# Altium project SCB.PrjPCB (part 1 of 8)
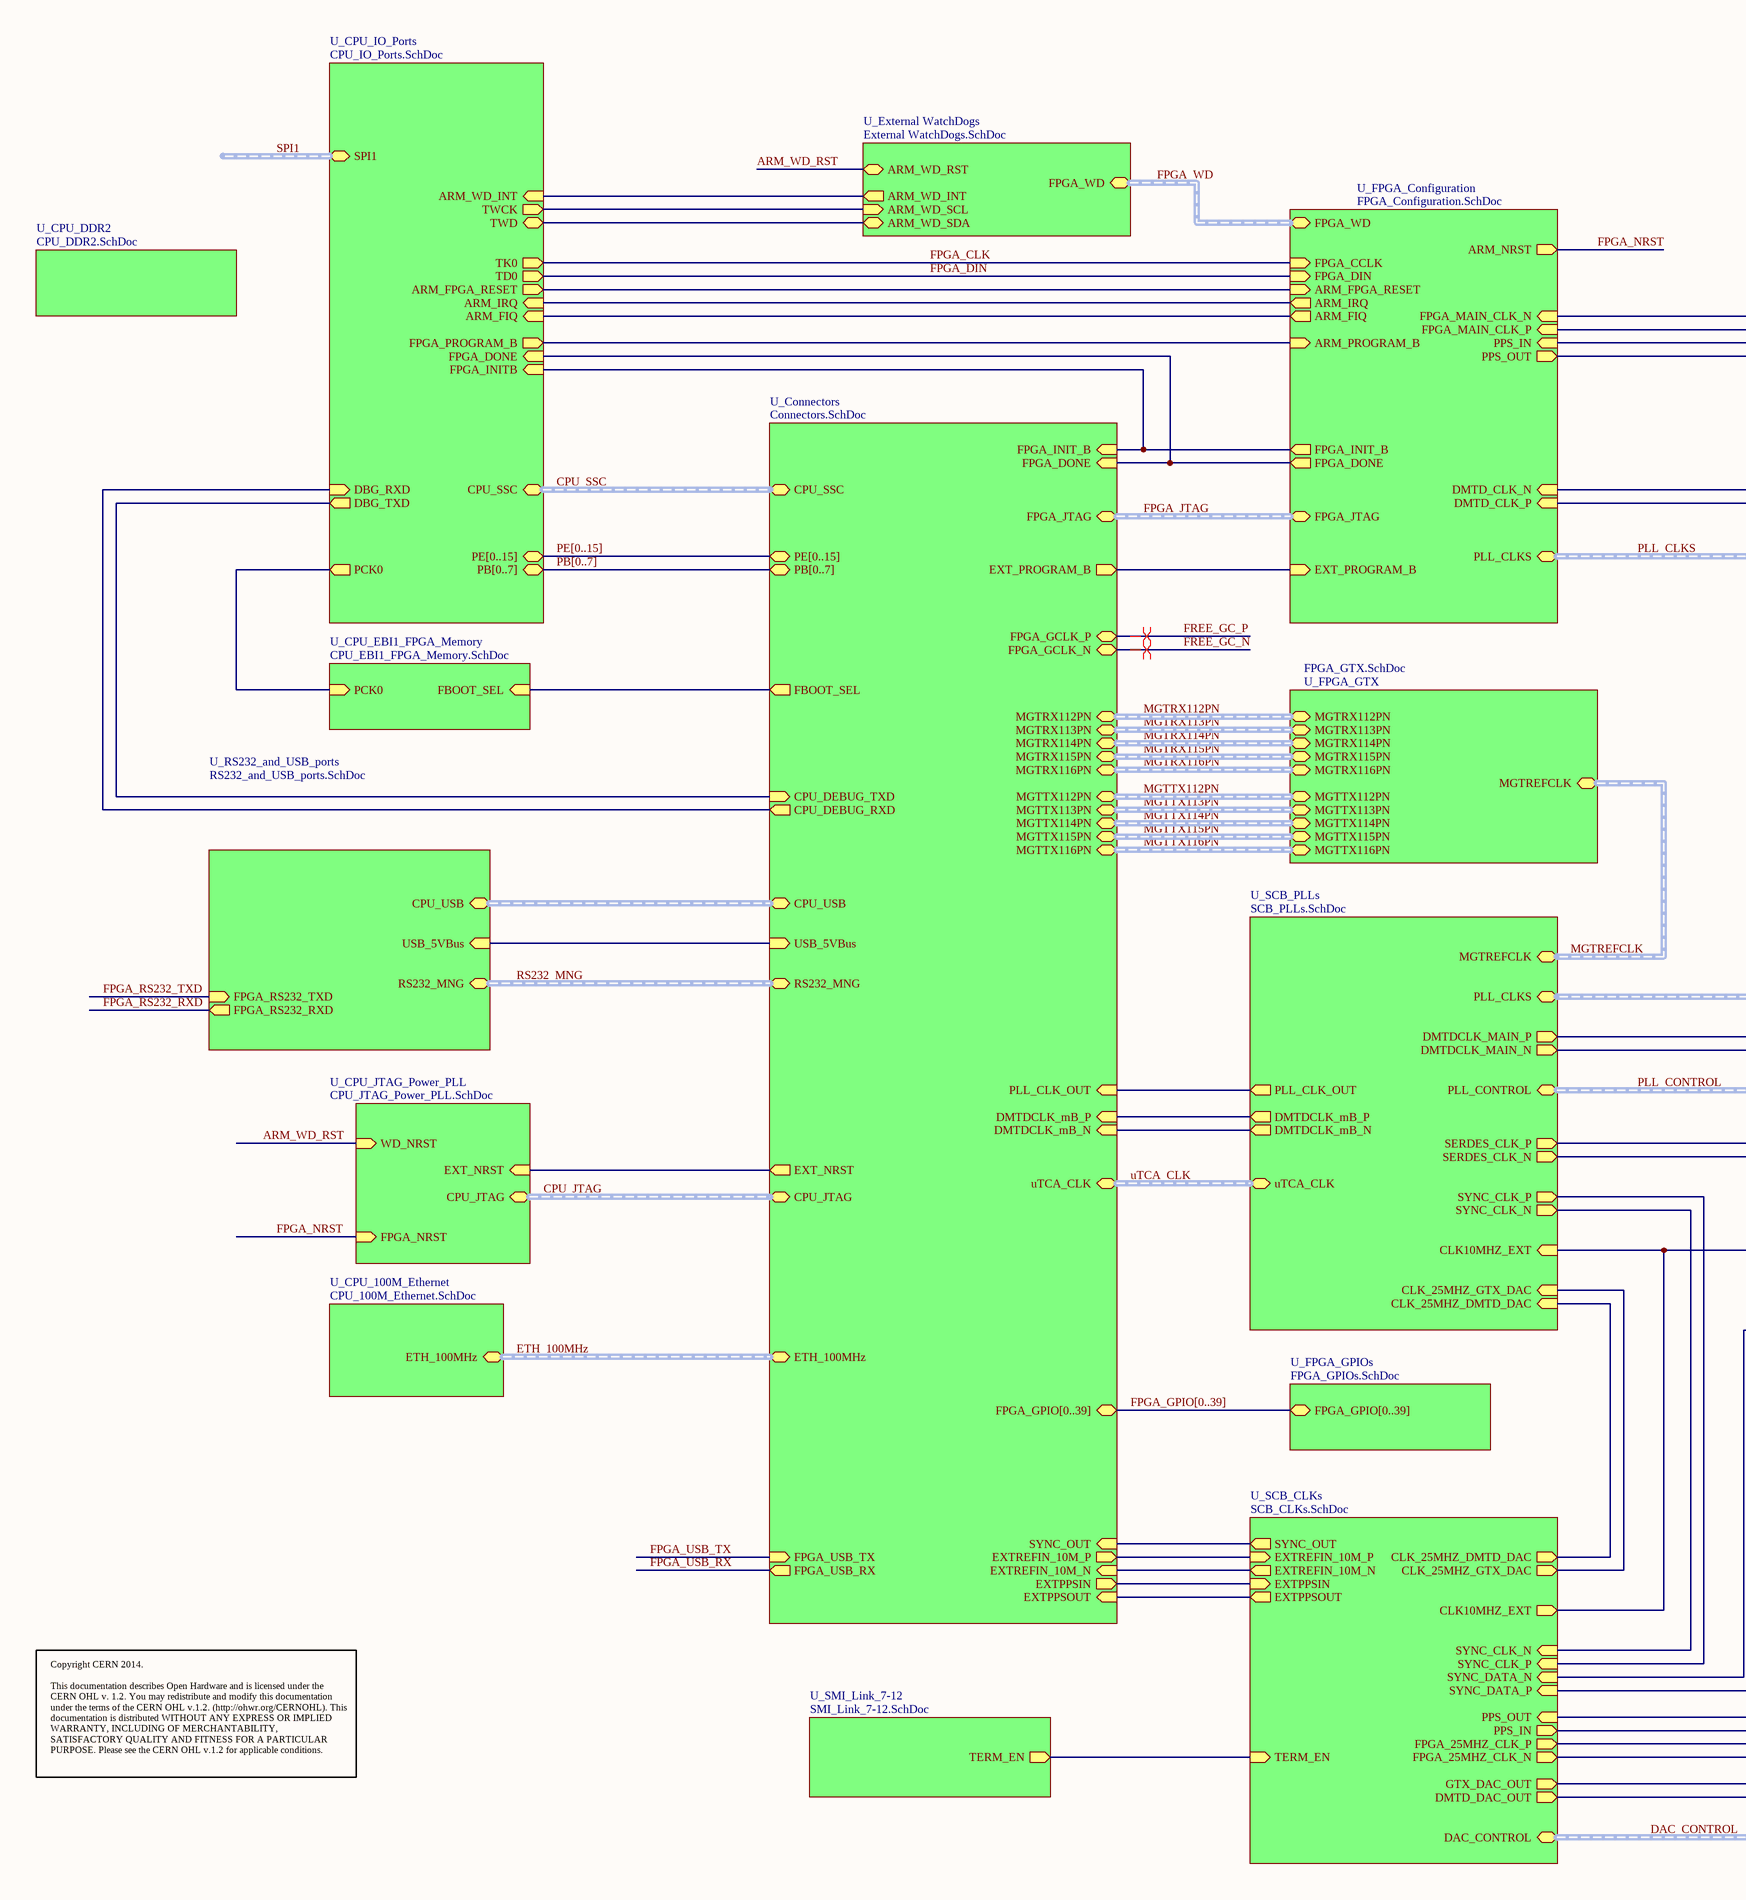
[diagram p0: SCB_MAIN.SchDoc, left]
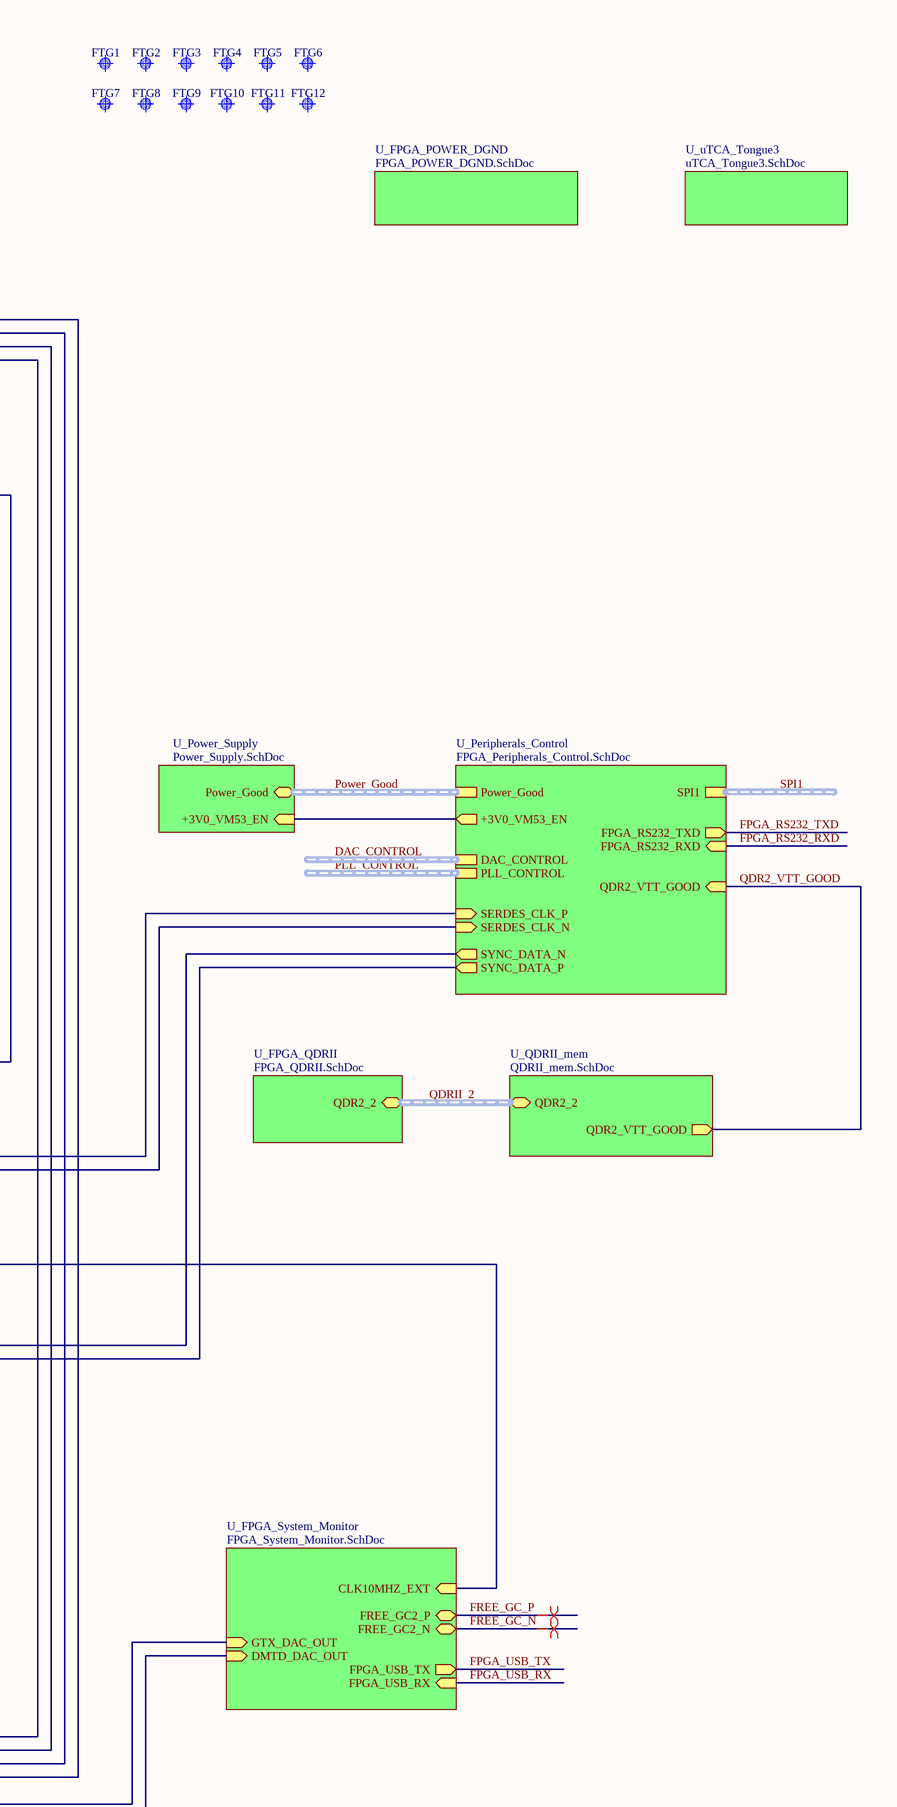
[diagram p1: SCB_MAIN.SchDoc, right]
23 sheets, 767 parts. Net scope: hierarchical (ports join the sheet entries above them; power ports are global).
Board file: uTCA_MCH_PCB3.pcbdoc
Sheets:
  SCB_MAIN.SchDoc
    U_Connectors = Connectors.SchDoc
    U_CPU_JTAG_Power_PLL = CPU_JTAG_Power_PLL.SchDoc
    U_RS232_and_USB_ports = RS232_and_USB_ports.SchDoc
    U_SCB_CLKs = SCB_CLKs.SchDoc
    U_FPGA_GTX = FPGA_GTX.SchDoc
    U_CPU_100M_Ethernet = CPU_100M_Ethernet.SchDoc
    U_SMI_Link_7-12 = SMI_Link_7-12.SchDoc
    U_uTCA_Tongue3 = uTCA_Tongue3.SchDoc
    U_External WatchDogs = External WatchDogs.SchDoc
    U_FPGA_Configuration = FPGA_Configuration.SchDoc
    U_CPU_IO_Ports = CPU_IO_Ports.SchDoc
    U_SCB_PLLs = SCB_PLLs.SchDoc
    U_FPGA_GPIOs = FPGA_GPIOs.SchDoc
    U_FPGA_System_Monitor = FPGA_System_Monitor.SchDoc
    U_Power_Supply = Power_Supply.SchDoc
    U_FPGA_POWER_DGND = FPGA_POWER_DGND.SchDoc
    U_QDRII_mem = QDRII_mem.SchDoc
      U_QDRII_power = QDRII_power.SchDoc
    U_FPGA_QDRII = FPGA_QDRII.SchDoc
    U_Peripherals_Control = FPGA_Peripherals_Control.SchDoc
    U_CPU_EBI1_FPGA_Memory = CPU_EBI1_FPGA_Memory.SchDoc
    U_CPU_DDR2 = CPU_DDR2.SchDoc

## Sheet SCB_MAIN.SchDoc: SCB_MAIN
size A2; Date: 18/06/2014; DrawnBy: J. Gabriel R.E.; Organization: Seven Solutions S.L.; Address1: C/Baza, Parcela 19, Nave 3; Address2: Polígono Ind. Juncaril; Address3: 18210-Peligros-Granada; Address4: Spain; Revision: 3.4; SheetNumber: 1; SheetTotal: 23; WebAddress: www.sevensols.com; Project: White Rabbit; ProjectName: Project Name

### Parts
FTG1  Use only in PCB  [FIDUCIAL_TOP_S100-200]  (value not drawn)
FTG2  Use only in PCB  [FIDUCIAL_TOP_S100-200]  (value not drawn)
FTG3  Use only in PCB  [FIDUCIAL_TOP_S100-200]  (value not drawn)
FTG4  Use only in PCB  [FIDUCIAL_TOP_S100-200]  (value not drawn)
FTG5  Use only in PCB  [FIDUCIAL_TOP_S100-200]  (value not drawn)
FTG6  Use only in PCB  [FIDUCIAL_TOP_S100-200]  (value not drawn)
FTG7  Use only in PCB  [FIDUCIAL_TOP_S100-200]  (value not drawn)
FTG8  Use only in PCB  [FIDUCIAL_TOP_S100-200]  (value not drawn)
FTG9  Use only in PCB  [FIDUCIAL_TOP_S100-200]  (value not drawn)
FTG10  Use only in PCB  [FIDUCIAL_TOP_S100-200]  (value not drawn)
FTG11  Use only in PCB  [FIDUCIAL_TOP_S100-200]  (value not drawn)
FTG12  Use only in PCB  [FIDUCIAL_TOP_S100-200]  (value not drawn)

### Sub-sheets
U_Connectors = Connectors.SchDoc: USB_5VBus (in), CPU_DEBUG_TXD (in), CPU_DEBUG_RXD (out), EXTPPSIN (out), EXTPPSOUT (in), FBOOT_SEL (out), EXT_NRST (out), FPGA_GCLK_P (bidir), EXT_PROGRAM_B (out), FPGA_DONE (in), FPGA_INIT_B (in), FPGA_GPIO[0..39] (bidir), DMTDCLK_mB_P (in), DMTDCLK_mB_N (in), FPGA_GCLK_N (bidir), MGTTX112PN (harness MGTTX112PN), MGTTX113PN (harness MGTTX113PN), MGTTX114PN (harness MGTTX114PN), MGTTX115PN (harness MGTTX115PN), MGTTX116PN (harness MGTTX116PN), MGTRX112PN (harness MGTRX112PN), MGTRX113PN (harness MGTRX113PN), MGTRX114PN (harness MGTRX114PN), MGTRX115PN (harness MGTRX115PN), MGTRX116PN (harness MGTRX116PN), ETH_100MHz (harness ETH_100MHz), uTCA_CLK (harness uTCA_CLK), CPU_JTAG (harness CPU_JTAG), FPGA_JTAG (harness FPGA_JTAG), CPU_SSC (harness CPU_SSC), RS232_MNG (harness RS232_MNG), PE[0..15] (bidir), PB[0..7] (bidir), CPU_USB (harness CPU_USB), EXTREFIN_10M_P (out), EXTREFIN_10M_N (in), FPGA_USB_TX (in), FPGA_USB_RX (out), PLL_CLK_OUT (in), SYNC_OUT (in)
U_CPU_100M_Ethernet = CPU_100M_Ethernet.SchDoc: ETH_100MHz (harness ETH_100MHz)
U_CPU_DDR2 = CPU_DDR2.SchDoc: no entries
U_CPU_EBI1_FPGA_Memory = CPU_EBI1_FPGA_Memory.SchDoc: FBOOT_SEL (in), PCK0 (in)
U_CPU_IO_Ports = CPU_IO_Ports.SchDoc: DBG_TXD (out), DBG_RXD (in), TK0 (out), TD0 (out), FPGA_DONE (in), FPGA_INITB (in), TWD (bidir), TWCK (out), ARM_WD_INT (in), FPGA_PROGRAM_B (out), CPU_SSC (harness CPU_SSC), SPI1 (harness SPI1), ARM_FPGA_RESET (out), PB[0..7] (bidir), PE[0..15] (bidir), ARM_FIQ (in), ARM_IRQ (in), PCK0 (out)
U_CPU_JTAG_Power_PLL = CPU_JTAG_Power_PLL.SchDoc: EXT_NRST (in), WD_NRST (in), FPGA_NRST (in), CPU_JTAG (harness CPU_JTAG)
U_External WatchDogs = External WatchDogs.SchDoc: ARM_WD_SCL (in), ARM_WD_SDA (bidir), ARM_WD_INT (out), ARM_WD_RST (bidir), FPGA_WD (harness FPGA_WD)
U_FPGA_Configuration = FPGA_Configuration.SchDoc: FPGA_DONE (out), FPGA_INIT_B (out), ARM_PROGRAM_B (in), FPGA_CCLK (in), FPGA_DIN (in), EXT_PROGRAM_B (in), ARM_NRST (out), ARM_FIQ (out), ARM_IRQ (out), DMTD_CLK_P (in), DMTD_CLK_N (in), PPS_IN (in), PPS_OUT (out), FPGA_MAIN_CLK_P (in), FPGA_MAIN_CLK_N (in), FPGA_JTAG (harness FPGA_JTAG), FPGA_WD (harness FPGA_WD), ARM_FPGA_RESET (in), PLL_CLKS (harness PLL_CLKS)
U_FPGA_GPIOs = FPGA_GPIOs.SchDoc: FPGA_GPIO[0..39] (bidir)
U_FPGA_GTX = FPGA_GTX.SchDoc: MGTREFCLK (harness MGTREFCLK), MGTRX116PN (harness MGTRX116PN), MGTRX115PN (harness MGTRX115PN), MGTRX114PN (harness MGTRX114PN), MGTRX113PN (harness MGTRX113PN), MGTRX112PN (harness MGTRX112PN), MGTTX112PN (harness MGTTX112PN), MGTTX113PN (harness MGTTX113PN), MGTTX114PN (harness MGTTX114PN), MGTTX115PN (harness MGTTX115PN), MGTTX116PN (harness MGTTX116PN)
U_FPGA_POWER_DGND = FPGA_POWER_DGND.SchDoc: no entries
U_FPGA_QDRII = FPGA_QDRII.SchDoc: QDR2_2 (harness qdr2_2_bus)
U_FPGA_System_Monitor = FPGA_System_Monitor.SchDoc: DMTD_DAC_OUT (in), GTX_DAC_OUT (in), FREE_GC2_P (bidir), FREE_GC2_N (bidir), CLK10MHZ_EXT (in), FPGA_USB_TX (out), FPGA_USB_RX (in)
U_Peripherals_Control = FPGA_Peripherals_Control.SchDoc: SPI1 (harness SPI1), Power_Good (harness Power-Good), DAC_CONTROL (harness DAC_CONTROL), PLL_CONTROL (harness PLL_CONTROL), QDR2_VTT_GOOD (in), +3V0_VM53_EN (out), FPGA_RS232_TXD (out), FPGA_RS232_RXD (in), SYNC_DATA_N (out), SYNC_DATA_P (out), SERDES_CLK_P (in), SERDES_CLK_N (in)
U_Power_Supply = Power_Supply.SchDoc: Power_Good (harness Power-Good), +3V0_VM53_EN (in)
U_QDRII_mem = QDRII_mem.SchDoc: QDR2_VTT_GOOD (out), QDR2_2 (harness qdr2_2_bus)
U_RS232_and_USB_ports = RS232_and_USB_ports.SchDoc: USB_5VBus (in), FPGA_RS232_TXD (in), FPGA_RS232_RXD (out), RS232_MNG (harness RS232_MNG), CPU_USB (harness CPU_USB)
U_SCB_CLKs = SCB_CLKs.SchDoc: CLK10MHZ_EXT (out), CLK_25MHZ_GTX_DAC (out), CLK_25MHZ_DMTD_DAC (out), EXTPPSIN (in), EXTPPSOUT (out), FPGA_25MHZ_CLK_P (out), FPGA_25MHZ_CLK_N (out), DMTD_DAC_OUT (out), GTX_DAC_OUT (out), PPS_IN (out), PPS_OUT (in), DAC_CONTROL (harness DAC_CONTROL), EXTREFIN_10M_P (in), EXTREFIN_10M_N (out), TERM_EN (in), SYNC_OUT (out), SYNC_CLK_N (in), SYNC_CLK_P (in), SYNC_DATA_N (in), SYNC_DATA_P (in)
U_SCB_PLLs = SCB_PLLs.SchDoc: CLK_25MHZ_GTX_DAC (in), CLK10MHZ_EXT (in), DMTDCLK_MAIN_P (out), DMTDCLK_MAIN_N (out), CLK_25MHZ_DMTD_DAC (in), DMTDCLK_mB_P (out), DMTDCLK_mB_N (out), PLL_CONTROL (harness PLL_CONTROL), MGTREFCLK (harness MGTREFCLK), uTCA_CLK (harness uTCA_CLK), PLL_CLKS (harness PLL_CLKS), PLL_CLK_OUT (out), SYNC_CLK_N (out), SYNC_CLK_P (out), SERDES_CLK_P (out), SERDES_CLK_N (out)
U_SMI_Link_7-12 = SMI_Link_7-12.SchDoc: TERM_EN (out)
U_uTCA_Tongue3 = uTCA_Tongue3.SchDoc: no entries

### Nets
+3V0_VM53_EN: sheet U_Power_Supply/+3V0_VM53_EN, sheet U_Peripherals_Control/+3V0_VM53_EN
ARM_DEBUG_RXD: sheet U_Connectors/CPU_DEBUG_RXD, sheet U_CPU_IO_Ports/DBG_RXD
ARM_DEBUG_TXD: sheet U_Connectors/CPU_DEBUG_TXD, sheet U_CPU_IO_Ports/DBG_TXD
ARM_FIQ: sheet U_FPGA_Configuration/ARM_FIQ, sheet U_CPU_IO_Ports/ARM_FIQ
ARM_FPGA_RESET: sheet U_FPGA_Configuration/ARM_FPGA_RESET, sheet U_CPU_IO_Ports/ARM_FPGA_RESET
ARM_IRQ: sheet U_FPGA_Configuration/ARM_IRQ, sheet U_CPU_IO_Ports/ARM_IRQ
ARM_PCK0: sheet U_CPU_IO_Ports/PCK0, sheet U_CPU_EBI1_FPGA_Memory/PCK0
ARM_PROGRAM_B: sheet U_FPGA_Configuration/ARM_PROGRAM_B, sheet U_CPU_IO_Ports/FPGA_PROGRAM_B
ARM_WD_RST: sheet U_CPU_JTAG_Power_PLL/WD_NRST, sheet U_External WatchDogs/ARM_WD_RST
CLK10MHZ_EXT: sheet U_SCB_CLKs/CLK10MHZ_EXT, sheet U_SCB_PLLs/CLK10MHZ_EXT, sheet U_FPGA_System_Monitor/CLK10MHZ_EXT
DMTD_CLK_N: sheet U_FPGA_Configuration/DMTD_CLK_N, sheet U_SCB_PLLs/DMTDCLK_MAIN_N
DMTD_CLK_P: sheet U_FPGA_Configuration/DMTD_CLK_P, sheet U_SCB_PLLs/DMTDCLK_MAIN_P
DMTDCLK_mB_N: sheet U_Connectors/DMTDCLK_mB_N, sheet U_SCB_PLLs/DMTDCLK_mB_N
DMTDCLK_mB_P: sheet U_Connectors/DMTDCLK_mB_P, sheet U_SCB_PLLs/DMTDCLK_mB_P
EXT_PROGRAM_B: sheet U_Connectors/EXT_PROGRAM_B, sheet U_FPGA_Configuration/EXT_PROGRAM_B
EXTREFIN_10M_N: sheet U_Connectors/EXTREFIN_10M_N, sheet U_SCB_CLKs/EXTREFIN_10M_N
EXTREFIN_10M_P: sheet U_Connectors/EXTREFIN_10M_P, sheet U_SCB_CLKs/EXTREFIN_10M_P
FBOOT_SEL: sheet U_Connectors/FBOOT_SEL, sheet U_CPU_EBI1_FPGA_Memory/FBOOT_SEL
FPGA_25MHZ_CLK_N: sheet U_SCB_CLKs/FPGA_25MHZ_CLK_N, sheet U_FPGA_Configuration/FPGA_MAIN_CLK_N
FPGA_25MHZ_CLK_P: sheet U_SCB_CLKs/FPGA_25MHZ_CLK_P, sheet U_FPGA_Configuration/FPGA_MAIN_CLK_P
FPGA_CLK: sheet U_FPGA_Configuration/FPGA_CCLK, sheet U_CPU_IO_Ports/TK0
FPGA_DIN: sheet U_FPGA_Configuration/FPGA_DIN, sheet U_CPU_IO_Ports/TD0
FPGA_DONE: sheet U_Connectors/FPGA_DONE, sheet U_FPGA_Configuration/FPGA_DONE, sheet U_CPU_IO_Ports/FPGA_DONE
FPGA_INIT_B: sheet U_Connectors/FPGA_INIT_B, sheet U_FPGA_Configuration/FPGA_INIT_B, sheet U_CPU_IO_Ports/FPGA_INITB
FPGA_NRST: sheet U_CPU_JTAG_Power_PLL/FPGA_NRST, sheet U_FPGA_Configuration/ARM_NRST  [project net ARM_NRST]
FPGA_RS232_RXD: sheet U_RS232_and_USB_ports/FPGA_RS232_RXD, sheet U_Peripherals_Control/FPGA_RS232_RXD
FPGA_RS232_TXD: sheet U_RS232_and_USB_ports/FPGA_RS232_TXD, sheet U_Peripherals_Control/FPGA_RS232_TXD
FPGA_USB_RX: sheet U_Connectors/FPGA_USB_RX, sheet U_FPGA_System_Monitor/FPGA_USB_RX
FPGA_USB_TX: sheet U_Connectors/FPGA_USB_TX, sheet U_FPGA_System_Monitor/FPGA_USB_TX
FREE_GC_N: sheet U_Connectors/FPGA_GCLK_N, sheet U_FPGA_System_Monitor/FREE_GC2_N  [project net FPGA_GCLK_N]
FREE_GC_P: sheet U_Connectors/FPGA_GCLK_P, sheet U_FPGA_System_Monitor/FREE_GC2_P  [project net FPGA_GCLK_P]
PLL_CLK_OUT: sheet U_Connectors/PLL_CLK_OUT, sheet U_SCB_PLLs/PLL_CLK_OUT
PPS_OUT: sheet U_SCB_CLKs/PPS_OUT, sheet U_FPGA_Configuration/PPS_OUT
QDR2_VTT_GOOD: sheet U_QDRII_mem/QDR2_VTT_GOOD, sheet U_Peripherals_Control/QDR2_VTT_GOOD
SERDES_CLK_N: sheet U_SCB_PLLs/SERDES_CLK_N, sheet U_Peripherals_Control/SERDES_CLK_N
SERDES_CLK_P: sheet U_SCB_PLLs/SERDES_CLK_P, sheet U_Peripherals_Control/SERDES_CLK_P
SYNC_CLK_N: sheet U_SCB_CLKs/SYNC_CLK_N, sheet U_SCB_PLLs/SYNC_CLK_N
SYNC_CLK_P: sheet U_SCB_CLKs/SYNC_CLK_P, sheet U_SCB_PLLs/SYNC_CLK_P
SYNC_DATA_N: sheet U_SCB_CLKs/SYNC_DATA_N, sheet U_Peripherals_Control/SYNC_DATA_N
SYNC_DATA_P: sheet U_SCB_CLKs/SYNC_DATA_P, sheet U_Peripherals_Control/SYNC_DATA_P
USB_5VBus: sheet U_Connectors/USB_5VBus, sheet U_RS232_and_USB_ports/USB_5VBus
NetC154_2: sheet U_SCB_CLKs/CLK_25MHZ_DMTD_DAC, sheet U_SCB_PLLs/CLK_25MHZ_DMTD_DAC
NetC185_1: sheet U_SCB_CLKs/CLK_25MHZ_GTX_DAC, sheet U_SCB_PLLs/CLK_25MHZ_GTX_DAC
NetD5_2: sheet U_Connectors/EXT_NRST, sheet U_CPU_JTAG_Power_PLL/EXT_NRST
NetIC2_6: sheet U_External WatchDogs/ARM_WD_SDA, sheet U_CPU_IO_Ports/TWD
NetIC2_7: sheet U_External WatchDogs/ARM_WD_SCL, sheet U_CPU_IO_Ports/TWCK
NetIC2_8: sheet U_External WatchDogs/ARM_WD_INT, sheet U_CPU_IO_Ports/ARM_WD_INT
NetIC5_3: sheet U_SCB_CLKs/GTX_DAC_OUT, sheet U_FPGA_System_Monitor/GTX_DAC_OUT
NetIC8_3: sheet U_SCB_CLKs/DMTD_DAC_OUT, sheet U_FPGA_System_Monitor/DMTD_DAC_OUT
NetIC33_AL34: sheet U_SCB_CLKs/TERM_EN, sheet U_SMI_Link_7-12/TERM_EN
NetIC33_J25: sheet U_SCB_CLKs/PPS_IN, sheet U_FPGA_Configuration/PPS_IN
NetP1_1: sheet U_Connectors/EXTPPSIN, sheet U_SCB_CLKs/EXTPPSIN
NetP3_1: sheet U_Connectors/SYNC_OUT, sheet U_SCB_CLKs/SYNC_OUT
NetP4_1: sheet U_Connectors/EXTPPSOUT, sheet U_SCB_CLKs/EXTPPSOUT

### Buses and harness runs
bus FPGA_GPIO[0..39] = sheet U_Connectors/FPGA_GPIO[0..39] = sheet U_FPGA_GPIOs/FPGA_GPIO[0..39]
bus PB[0..7] = sheet U_Connectors/PB[0..7] = sheet U_CPU_IO_Ports/PB[0..7]
bus PE[0..15] = sheet U_Connectors/PE[0..15] = sheet U_CPU_IO_Ports/PE[0..15]
harness CPU_JTAG = sheet U_Connectors/CPU_JTAG = sheet U_CPU_JTAG_Power_PLL/CPU_JTAG
harness CPU_SSC = sheet U_Connectors/CPU_SSC = sheet U_CPU_IO_Ports/CPU_SSC
harness DAC_CONTROL = sheet U_Peripherals_Control/DAC_CONTROL
harness DAC_CONTROL = sheet U_SCB_CLKs/DAC_CONTROL
harness ETH_100MHz = sheet U_Connectors/ETH_100MHz = sheet U_CPU_100M_Ethernet/ETH_100MHz
harness FPGA_JTAG = sheet U_Connectors/FPGA_JTAG = sheet U_FPGA_Configuration/FPGA_JTAG
harness FPGA_WD = sheet U_External WatchDogs/FPGA_WD = sheet U_FPGA_Configuration/FPGA_WD
harness MGTREFCLK = sheet U_FPGA_GTX/MGTREFCLK = sheet U_SCB_PLLs/MGTREFCLK
harness MGTRX112PN = sheet U_Connectors/MGTRX112PN = sheet U_FPGA_GTX/MGTRX112PN
harness MGTRX113PN = sheet U_Connectors/MGTRX113PN = sheet U_FPGA_GTX/MGTRX113PN
harness MGTRX114PN = sheet U_Connectors/MGTRX114PN = sheet U_FPGA_GTX/MGTRX114PN
harness MGTRX115PN = sheet U_Connectors/MGTRX115PN = sheet U_FPGA_GTX/MGTRX115PN
harness MGTRX116PN = sheet U_Connectors/MGTRX116PN = sheet U_FPGA_GTX/MGTRX116PN
harness MGTTX112PN = sheet U_Connectors/MGTTX112PN = sheet U_FPGA_GTX/MGTTX112PN
harness MGTTX113PN = sheet U_Connectors/MGTTX113PN = sheet U_FPGA_GTX/MGTTX113PN
harness MGTTX114PN = sheet U_Connectors/MGTTX114PN = sheet U_FPGA_GTX/MGTTX114PN
harness MGTTX115PN = sheet U_Connectors/MGTTX115PN = sheet U_FPGA_GTX/MGTTX115PN
harness MGTTX116PN = sheet U_Connectors/MGTTX116PN = sheet U_FPGA_GTX/MGTTX116PN
harness PLL_CLKS = sheet U_FPGA_Configuration/PLL_CLKS = sheet U_SCB_PLLs/PLL_CLKS
harness PLL_CONTROL = sheet U_Peripherals_Control/PLL_CONTROL
harness PLL_CONTROL = sheet U_SCB_PLLs/PLL_CONTROL
harness Power_Good = sheet U_Peripherals_Control/Power_Good = sheet U_Power_Supply/Power_Good
harness QDRII_2 = sheet U_FPGA_QDRII/QDR2_2 = sheet U_QDRII_mem/QDR2_2
harness RS232_MNG = sheet U_Connectors/RS232_MNG = sheet U_RS232_and_USB_ports/RS232_MNG
harness sheet U_Connectors/CPU_USB = sheet U_RS232_and_USB_ports/CPU_USB
harness SPI1 = sheet U_CPU_IO_Ports/SPI1
harness SPI1 = sheet U_Peripherals_Control/SPI1
harness uTCA_CLK = sheet U_Connectors/uTCA_CLK = sheet U_SCB_PLLs/uTCA_CLK

### Layout directives
differential pair: FPGA_GCLK_N, FPGA_GCLK_P

### Notes on the sheet
- Copyright CERN 2014.
  This documentation describes Open Hardware and is licensed under the CERN OHL v. 1.2. You may redistribute and modify this documentation under the terms of the CERN OHL v.1.2. (http://ohwr.org/CERNOHL). This documentation is distributed WITHOUT ANY EXPRESS OR IMPLIED WARRANTY, INCLUDING OF MERCHANTABILITY, SATISFACTORY QUALITY AND FITNESS FOR A PARTICULAR PURPOSE. Please see the CERN OHL v.1.2 for applicable conditions.
- Title:
- Size:
- Project:
- Revision:
- A2
- Drawn by:
- Date:
- Sheet
- of

### Library data of the parts
FTG1-FTG12 = FIDUCIAL_TARGET_S100-200: Fiducial Target; Part Description: Scare Fiducial Target, Top Layer, 1.0mm, Top Sloder 2.0mm, Keepout =2.0mm; Mounted: No; Table: Pads; Part Number: FIDUCIAL_TARGET_S100-200; Component Kind: Standard (No BOM); Component Type: Standard (No BOM); Pin Count: 1; Family: Fiducial; Socket: No; SMD: Yes; Status: None; ComponentHeight: 0mm; Author: CERN DEM JLC; CreateDate: 2/9/2010; LatestRevisionDate: 2/9/2010; PackageDescription: Scare Fiducial Target, Top Layer, 1.0mm, Top Sloder 2.0mm, Keepout =2.0mm

## Sheet Connectors.SchDoc: Connectors
size A3; Date: 18/06/2014; DrawnBy: J. Gabriel R.E.; Organization: Seven Solutions S.L.; Address1: C/Baza, Parcela 19, Nave 3; Address2: Polígono Ind. Juncaril; Address3: 18210-Peligros-Granada; Address4: Spain; Revision: 3.4; SheetNumber: 15; SheetTotal: 23; WebAddress: www.sevensols.com; Project: White Rabbit; ProjectName: Project Name
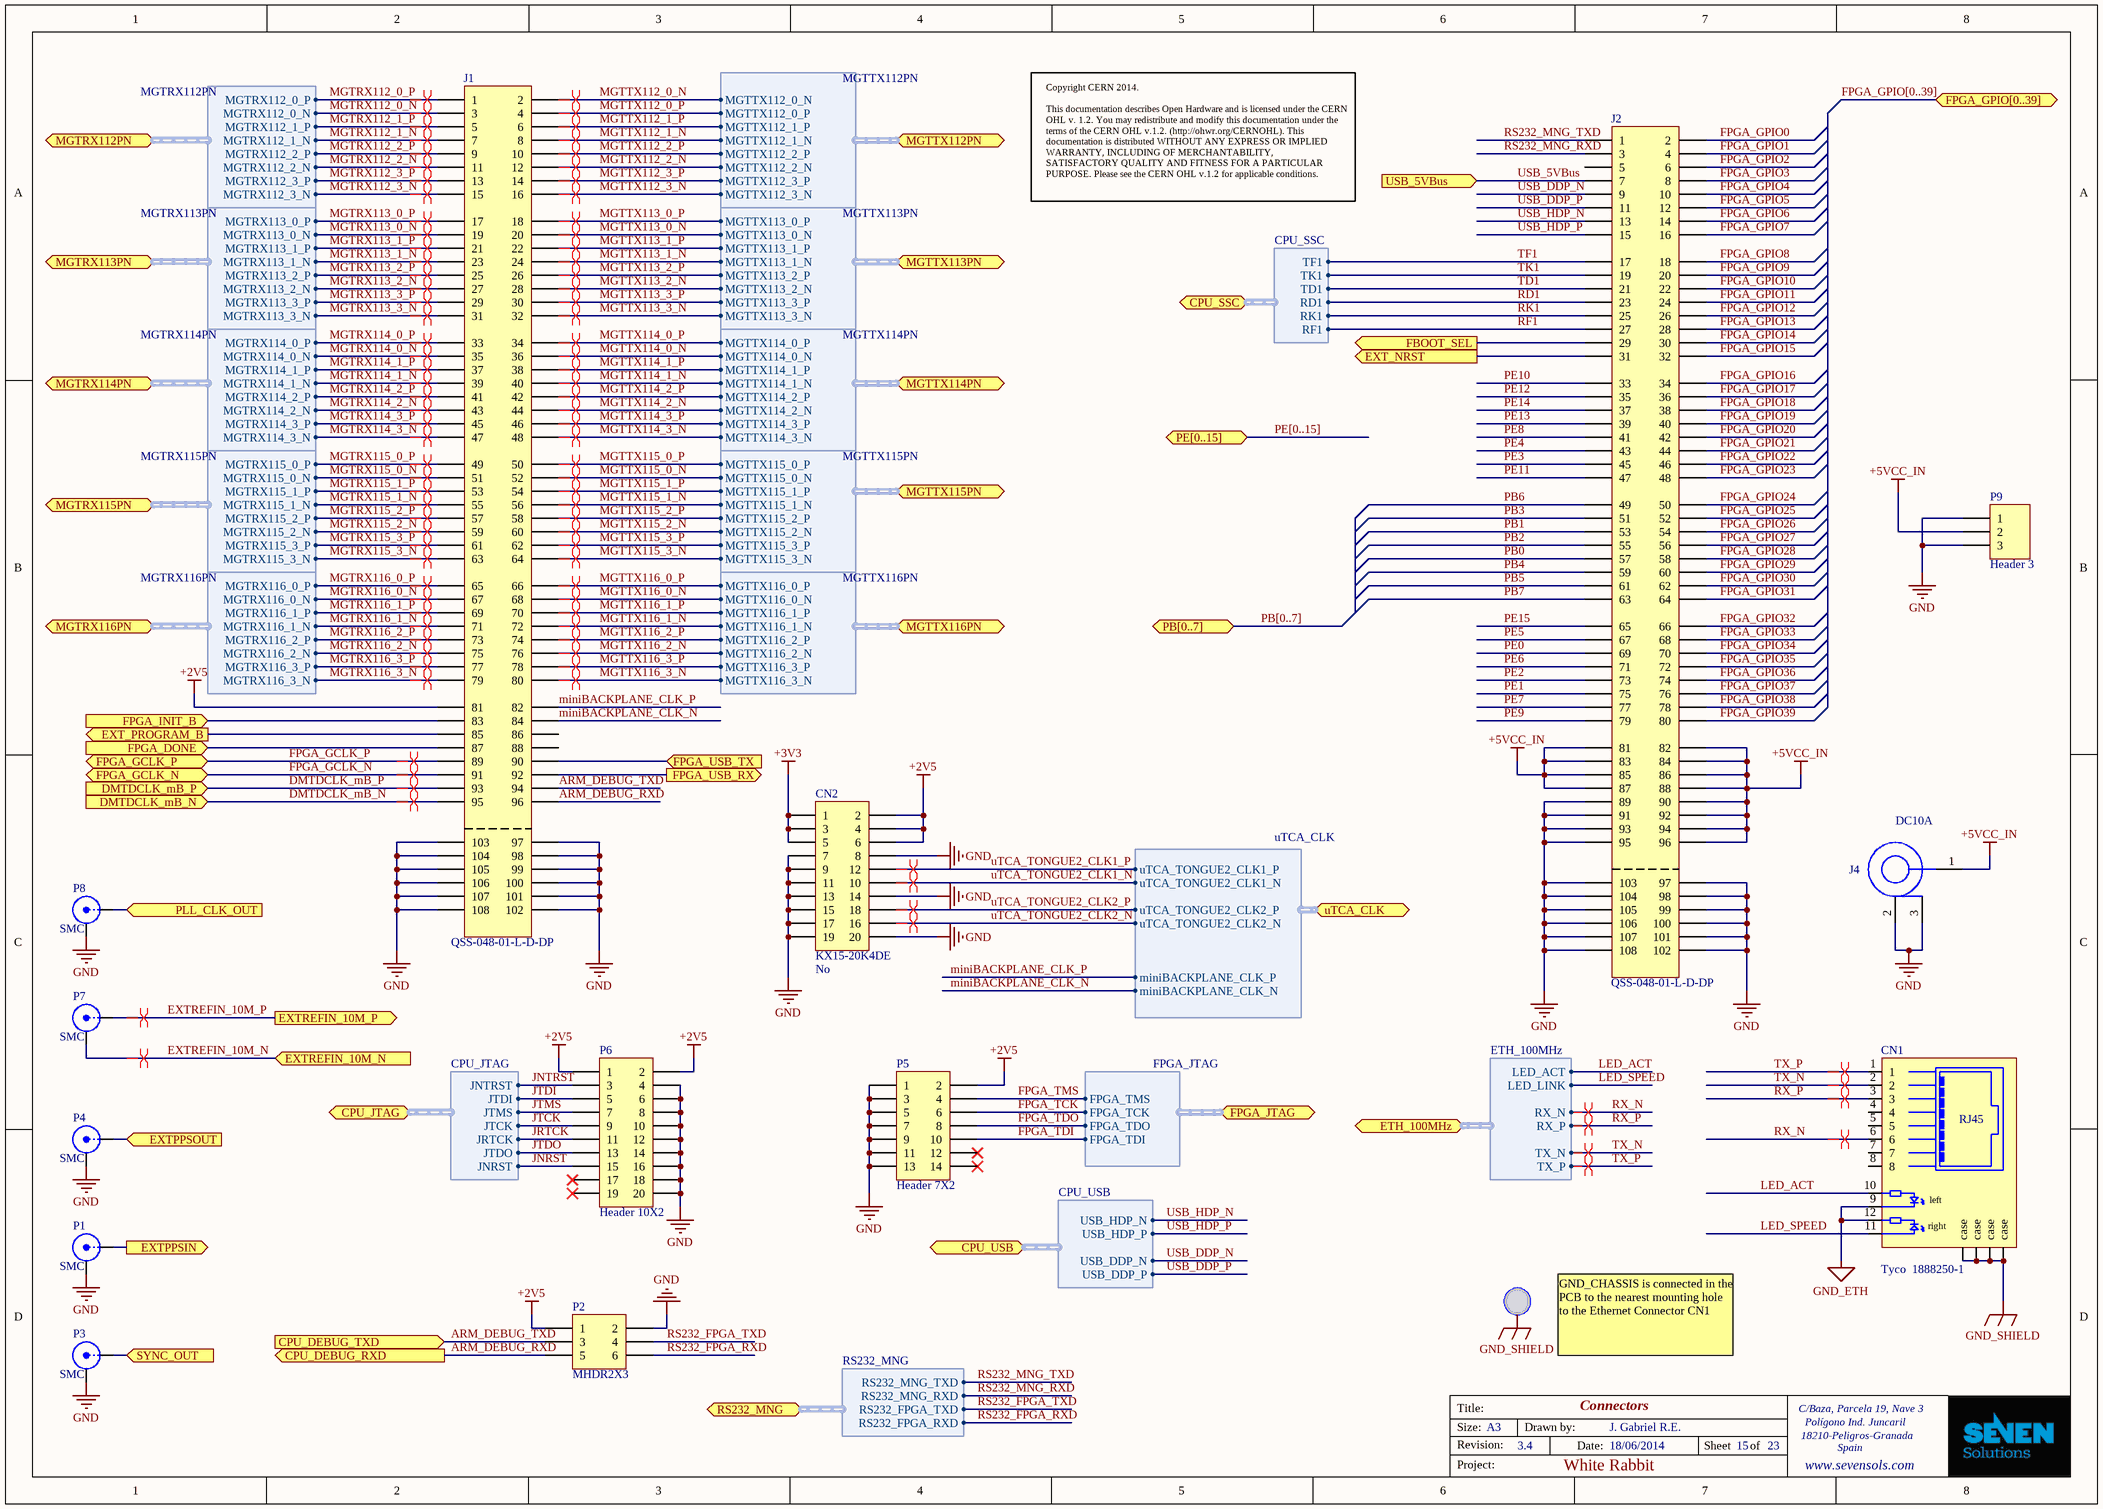
[diagram p2: Connectors.SchDoc]

### Parts
CN1  Tyco  1888250-1  [TYCO_ETHERNET_1888250-1]
CN2  KX15-20K4DE  Mounted: No  [JAE_KX15_20P]
J1  QSS-048-01-L-D-DP  [QSS-048-01-X-D-DP-A]
J2  QSS-048-01-L-D-DP  [QSS-048-01-X-D-DP-A]
J4  DC10A  [dc-10]
P1  SMC  [SMB_V-RJ45]
P2  MHDR2X3  [HDR2x3_M22]
P3  SMC  [SMB_V-RJ45]
P4  SMC  [SMB_V-RJ45]
P5  Header 7X2  [CONN_HDR_SMD_2mm_2x7]
P6  Header 10X2  [HDR2X10_SBH11]
P7  SMC  [SMB_V-RJ45]
P8  SMC  [SMB_V-RJ45]
P9  Header 3  [HDR1x3_BG055]

### Ports
CPU_DEBUG_RXD (out), CPU_DEBUG_TXD (in), CPU_JTAG (harness CPU_JTAG), CPU_SSC (harness CPU_SSC), CPU_USB (harness CPU_USB), DMTDCLK_mB_N (in), DMTDCLK_mB_P (in), ETH_100MHz (harness ETH_100MHz), EXT_NRST (out), EXT_PROGRAM_B (out), EXTPPSIN (out), EXTPPSOUT (in), EXTREFIN_10M_N (in), EXTREFIN_10M_P (out), FBOOT_SEL (out), FPGA_DONE (in), FPGA_GCLK_N (bidir), FPGA_GCLK_P (bidir), FPGA_GPIO[0..39] (bidir), FPGA_INIT_B (in), FPGA_JTAG (harness FPGA_JTAG), FPGA_USB_RX (out), FPGA_USB_TX (in), MGTRX112PN (harness MGTRX112PN), MGTRX113PN (harness MGTRX113PN), MGTRX114PN (harness MGTRX114PN), MGTRX115PN (harness MGTRX115PN), MGTRX116PN (harness MGTRX116PN), MGTTX112PN (harness MGTTX112PN), MGTTX113PN (harness MGTTX113PN), MGTTX114PN (harness MGTTX114PN), MGTTX115PN (harness MGTTX115PN), MGTTX116PN (harness MGTTX116PN), PB[0..7] (bidir), PE[0..15] (bidir), PLL_CLK_OUT (in), RS232_MNG (harness RS232_MNG), SYNC_OUT (in), USB_5VBus (in), uTCA_CLK (harness uTCA_CLK)

### Harnesses
MGTTX112PN: MGTTX112_0_P, MGTTX112_0_N, MGTTX112_1_P, MGTTX112_1_N, MGTTX112_2_P, MGTTX112_2_N, MGTTX112_3_P, MGTTX112_3_N
MGTTX113PN: MGTTX113_0_P, MGTTX113_0_N, MGTTX113_1_P, MGTTX113_1_N, MGTTX113_2_P, MGTTX113_2_N, MGTTX113_3_P, MGTTX113_3_N
MGTTX114PN: MGTTX114_0_P, MGTTX114_0_N, MGTTX114_1_P, MGTTX114_1_N, MGTTX114_2_P, MGTTX114_2_N, MGTTX114_3_P, MGTTX114_3_N
MGTTX115PN: MGTTX115_0_P, MGTTX115_0_N, MGTTX115_1_P, MGTTX115_1_N, MGTTX115_2_P, MGTTX115_2_N, MGTTX115_3_P, MGTTX115_3_N
MGTTX116PN: MGTTX116_0_P, MGTTX116_0_N, MGTTX116_1_P, MGTTX116_1_N, MGTTX116_2_P, MGTTX116_2_N, MGTTX116_3_P, MGTTX116_3_N
MGTRX112PN: MGTRX112_0_P, MGTRX112_0_N, MGTRX112_1_P, MGTRX112_1_N, MGTRX112_2_P, MGTRX112_2_N, MGTRX112_3_P, MGTRX112_3_N
MGTRX113PN: MGTRX113_0_P, MGTRX113_0_N, MGTRX113_1_P, MGTRX113_1_N, MGTRX113_2_P, MGTRX113_2_N, MGTRX113_3_P, MGTRX113_3_N
MGTRX114PN: MGTRX114_0_P, MGTRX114_0_N, MGTRX114_1_P, MGTRX114_1_N, MGTRX114_2_P, MGTRX114_2_N, MGTRX114_3_P, MGTRX114_3_N
MGTRX115PN: MGTRX115_0_P, MGTRX115_0_N, MGTRX115_1_P, MGTRX115_1_N, MGTRX115_2_P, MGTRX115_2_N, MGTRX115_3_P, MGTRX115_3_N
MGTRX116PN: MGTRX116_0_P, MGTRX116_0_N, MGTRX116_1_P, MGTRX116_1_N, MGTRX116_2_P, MGTRX116_2_N, MGTRX116_3_P, MGTRX116_3_N
ETH_100MHz: RX_P, TX_P, TX_N, RX_N, LED_LINK, LED_ACT
CPU_JTAG: JNRST, JTDO, JRTCK, JTCK, JTMS, JTDI, JNTRST
FPGA_JTAG: FPGA_TMS, FPGA_TCK, FPGA_TDI, FPGA_TDO
RS232_MNG: RS232_MNG_TXD, RS232_FPGA_TXD, RS232_MNG_RXD, RS232_FPGA_RXD
uTCA_CLK: uTCA_TONGUE2_CLK1_P, uTCA_TONGUE2_CLK1_N, uTCA_TONGUE2_CLK2_P, uTCA_TONGUE2_CLK2_N, miniBACKPLANE_CLK_P, miniBACKPLANE_CLK_N
CPU_USB: USB_HDP_P, USB_HDP_N, USB_DDP_P, USB_DDP_N
CPU_SSC: TF1, TK1, TD1, RD1, RK1, RF1

### Nets
+2V5: CN2.2 CN2.4 CN2.6 J1.81 P2.1 P5.2 P6.1 P6.2
+3V3: CN2.1 CN2.3 CN2.5
+5VCC_IN: J2.81 J2.82 J2.83 J2.84 J2.85 J2.86 J2.87 J2.88 J2.90 J2.92 J2.94 J2.96 J4.1(P1) P9.2
GND: CN2.7 CN2.8 CN2.9 CN2.11 CN2.13 CN2.14 CN2.15 CN2.17 CN2.19 CN2.20 J1.97 J1.98 J1.99 J1.100 J1.101 J1.102 J1.103 J1.104 J1.105 J1.106 J1.107 J1.108 J2.89 J2.91 J2.93 J2.95 J2.97 J2.98 J2.99 J2.100 J2.101 J2.102 J2.103 J2.104 J2.105 J2.106 J2.107 J2.108 J4.2(P2) J4.3(P3) P1.2(Y) P2.2 P3.2(Y) P4.2(Y) P5.1 P5.3 P5.5 P5.7 P5.9 P5.11 P5.13 P6.4 P6.6 P6.8 P6.10 P6.12 P6.14 P6.16 P6.18 P6.20 P8.2(Y) P9.1 P9.3
GND_ETH: CN1.9(D2) CN1.12(D3)
GND_SHIELD: CN1.0(case)
ARM_DEBUG_RXD: J1.96 P2.5 ; port CPU_DEBUG_RXD
ARM_DEBUG_TXD: J1.94 P2.3 ; port CPU_DEBUG_TXD
DMTDCLK_mB_N: J1.95 ; port DMTDCLK_mB_N
DMTDCLK_mB_P: J1.93 ; port DMTDCLK_mB_P
EXT_PROGRAM_B: J1.85 ; port EXT_PROGRAM_B
EXTREFIN_10M_N: P7.2(Y) ; port EXTREFIN_10M_N
EXTREFIN_10M_P: P7.1(X) ; port EXTREFIN_10M_P
FBOOT_SEL: J2.29 ; port FBOOT_SEL
FPGA_DONE: J1.87 ; port FPGA_DONE
FPGA_GCLK_N: J1.91 ; port FPGA_GCLK_N
FPGA_GCLK_P: J1.89 ; port FPGA_GCLK_P
FPGA_GPIO0: J2.2
FPGA_GPIO1: J2.4
FPGA_GPIO2: J2.6
FPGA_GPIO3: J2.8
FPGA_GPIO4: J2.10
FPGA_GPIO5: J2.12
FPGA_GPIO6: J2.14
FPGA_GPIO7: J2.16
FPGA_GPIO8: J2.18
FPGA_GPIO9: J2.20
FPGA_GPIO10: J2.22
FPGA_GPIO11: J2.24
FPGA_GPIO12: J2.26
FPGA_GPIO13: J2.28
FPGA_GPIO14: J2.30
FPGA_GPIO15: J2.32
FPGA_GPIO16: J2.34
FPGA_GPIO17: J2.36
FPGA_GPIO18: J2.38
FPGA_GPIO19: J2.40
FPGA_GPIO20: J2.42
FPGA_GPIO21: J2.44
FPGA_GPIO22: J2.46
FPGA_GPIO23: J2.48
FPGA_GPIO24: J2.50
FPGA_GPIO25: J2.52
FPGA_GPIO26: J2.54
FPGA_GPIO27: J2.56
FPGA_GPIO28: J2.58
FPGA_GPIO29: J2.60
FPGA_GPIO30: J2.62
FPGA_GPIO31: J2.64
FPGA_GPIO32: J2.66
FPGA_GPIO33: J2.68
FPGA_GPIO34: J2.70
FPGA_GPIO35: J2.72
FPGA_GPIO36: J2.74
FPGA_GPIO37: J2.76
FPGA_GPIO38: J2.78
FPGA_GPIO39: J2.80
FPGA_INIT_B: J1.83 ; port FPGA_INIT_B
FPGA_TCK: P5.6 ; port FPGA_JTAG.FPGA_TCK  [project net FPGA_JTAG.FPGA_TCK]
FPGA_TDI: P5.10 ; port FPGA_JTAG.FPGA_TDI  [project net FPGA_JTAG.FPGA_TDI]
FPGA_TDO: P5.8 ; port FPGA_JTAG.FPGA_TDO  [project net FPGA_JTAG.FPGA_TDO]
FPGA_TMS: P5.4 ; port FPGA_JTAG.FPGA_TMS  [project net FPGA_JTAG.FPGA_TMS]
FPGA_USB_RX: J1.92 ; port FPGA_USB_RX
FPGA_USB_TX: J1.90 ; port FPGA_USB_TX
JNRST: P6.15 ; port CPU_JTAG.JNRST  [project net CPU_JTAG.JNRST]
JNTRST: P6.3 ; port CPU_JTAG.JNTRST  [project net CPU_JTAG.JNTRST]
JRTCK: P6.11 ; port CPU_JTAG.JRTCK  [project net CPU_JTAG.JRTCK]
JTCK: P6.9 ; port CPU_JTAG.JTCK  [project net CPU_JTAG.JTCK]
JTDI: P6.5 ; port CPU_JTAG.JTDI  [project net CPU_JTAG.JTDI]
JTDO: P6.13 ; port CPU_JTAG.JTDO  [project net CPU_JTAG.JTDO]
JTMS: P6.7 ; port CPU_JTAG.JTMS  [project net CPU_JTAG.JTMS]
LED_ACT: CN1.10(D1) ; port ETH_100MHz.LED_ACT  [project net ETH_100MHz.LED_ACT]
LED_SPEED: CN1.11(D4) ; port ETH_100MHz.LED_LINK  [project net ETH_100MHz.LED_LINK]
MGTRX112_0_N: J1.3 ; port MGTRX112PN.MGTRX112_0_N
MGTRX112_0_P: J1.1 ; port MGTRX112PN.MGTRX112_0_P
MGTRX112_1_N: J1.7 ; port MGTRX112PN.MGTRX112_1_N
MGTRX112_1_P: J1.5 ; port MGTRX112PN.MGTRX112_1_P
MGTRX112_2_N: J1.11 ; port MGTRX112PN.MGTRX112_2_N
MGTRX112_2_P: J1.9 ; port MGTRX112PN.MGTRX112_2_P
MGTRX112_3_N: J1.15 ; port MGTRX112PN.MGTRX112_3_N
MGTRX112_3_P: J1.13 ; port MGTRX112PN.MGTRX112_3_P
MGTRX113_0_N: J1.19 ; port MGTRX113PN.MGTRX113_0_N
MGTRX113_0_P: J1.17 ; port MGTRX113PN.MGTRX113_0_P
MGTRX113_1_N: J1.23 ; port MGTRX113PN.MGTRX113_1_N
MGTRX113_1_P: J1.21 ; port MGTRX113PN.MGTRX113_1_P
MGTRX113_2_N: J1.27 ; port MGTRX113PN.MGTRX113_2_N
MGTRX113_2_P: J1.25 ; port MGTRX113PN.MGTRX113_2_P
MGTRX113_3_N: J1.31 ; port MGTRX113PN.MGTRX113_3_N
MGTRX113_3_P: J1.29 ; port MGTRX113PN.MGTRX113_3_P
MGTRX114_0_N: J1.35 ; port MGTRX114PN.MGTRX114_0_N
MGTRX114_0_P: J1.33 ; port MGTRX114PN.MGTRX114_0_P
MGTRX114_1_N: J1.39 ; port MGTRX114PN.MGTRX114_1_N
MGTRX114_1_P: J1.37 ; port MGTRX114PN.MGTRX114_1_P
MGTRX114_2_N: J1.43 ; port MGTRX114PN.MGTRX114_2_N
MGTRX114_2_P: J1.41 ; port MGTRX114PN.MGTRX114_2_P
MGTRX114_3_N: J1.47 ; port MGTRX114PN.MGTRX114_3_N
MGTRX114_3_P: J1.45 ; port MGTRX114PN.MGTRX114_3_P
MGTRX115_0_N: J1.51 ; port MGTRX115PN.MGTRX115_0_N
MGTRX115_0_P: J1.49 ; port MGTRX115PN.MGTRX115_0_P
MGTRX115_1_N: J1.55 ; port MGTRX115PN.MGTRX115_1_N
MGTRX115_1_P: J1.53 ; port MGTRX115PN.MGTRX115_1_P
MGTRX115_2_N: J1.59 ; port MGTRX115PN.MGTRX115_2_N
MGTRX115_2_P: J1.57 ; port MGTRX115PN.MGTRX115_2_P
MGTRX115_3_N: J1.63 ; port MGTRX115PN.MGTRX115_3_N
MGTRX115_3_P: J1.61 ; port MGTRX115PN.MGTRX115_3_P
MGTRX116_0_N: J1.67 ; port MGTRX116PN.MGTRX116_0_N
MGTRX116_0_P: J1.65 ; port MGTRX116PN.MGTRX116_0_P
MGTRX116_1_N: J1.71 ; port MGTRX116PN.MGTRX116_1_N
MGTRX116_1_P: J1.69 ; port MGTRX116PN.MGTRX116_1_P
MGTRX116_2_N: J1.75 ; port MGTRX116PN.MGTRX116_2_N
MGTRX116_2_P: J1.73 ; port MGTRX116PN.MGTRX116_2_P
MGTRX116_3_N: J1.79 ; port MGTRX116PN.MGTRX116_3_N
MGTRX116_3_P: J1.77 ; port MGTRX116PN.MGTRX116_3_P
MGTTX112_0_N: J1.2 ; port MGTTX112PN.MGTTX112_0_N
MGTTX112_0_P: J1.4 ; port MGTTX112PN.MGTTX112_0_P
MGTTX112_1_N: J1.8 ; port MGTTX112PN.MGTTX112_1_N
MGTTX112_1_P: J1.6 ; port MGTTX112PN.MGTTX112_1_P
MGTTX112_2_N: J1.12 ; port MGTTX112PN.MGTTX112_2_N
MGTTX112_2_P: J1.10 ; port MGTTX112PN.MGTTX112_2_P
MGTTX112_3_N: J1.16 ; port MGTTX112PN.MGTTX112_3_N
MGTTX112_3_P: J1.14 ; port MGTTX112PN.MGTTX112_3_P
MGTTX113_0_N: J1.20 ; port MGTTX113PN.MGTTX113_0_N
MGTTX113_0_P: J1.18 ; port MGTTX113PN.MGTTX113_0_P
MGTTX113_1_N: J1.24 ; port MGTTX113PN.MGTTX113_1_N
MGTTX113_1_P: J1.22 ; port MGTTX113PN.MGTTX113_1_P
MGTTX113_2_N: J1.28 ; port MGTTX113PN.MGTTX113_2_N
MGTTX113_2_P: J1.26 ; port MGTTX113PN.MGTTX113_2_P
MGTTX113_3_N: J1.32 ; port MGTTX113PN.MGTTX113_3_N
MGTTX113_3_P: J1.30 ; port MGTTX113PN.MGTTX113_3_P
MGTTX114_0_N: J1.36 ; port MGTTX114PN.MGTTX114_0_N
MGTTX114_0_P: J1.34 ; port MGTTX114PN.MGTTX114_0_P
MGTTX114_1_N: J1.40 ; port MGTTX114PN.MGTTX114_1_N
MGTTX114_1_P: J1.38 ; port MGTTX114PN.MGTTX114_1_P
MGTTX114_2_N: J1.44 ; port MGTTX114PN.MGTTX114_2_N
MGTTX114_2_P: J1.42 ; port MGTTX114PN.MGTTX114_2_P
MGTTX114_3_N: J1.48 ; port MGTTX114PN.MGTTX114_3_N
MGTTX114_3_P: J1.46 ; port MGTTX114PN.MGTTX114_3_P
MGTTX115_0_N: J1.52 ; port MGTTX115PN.MGTTX115_0_N
MGTTX115_0_P: J1.50 ; port MGTTX115PN.MGTTX115_0_P
MGTTX115_1_N: J1.56 ; port MGTTX115PN.MGTTX115_1_N
MGTTX115_1_P: J1.54 ; port MGTTX115PN.MGTTX115_1_P
MGTTX115_2_N: J1.60 ; port MGTTX115PN.MGTTX115_2_N
MGTTX115_2_P: J1.58 ; port MGTTX115PN.MGTTX115_2_P
MGTTX115_3_N: J1.64 ; port MGTTX115PN.MGTTX115_3_N
MGTTX115_3_P: J1.62 ; port MGTTX115PN.MGTTX115_3_P
MGTTX116_0_N: J1.68 ; port MGTTX116PN.MGTTX116_0_N
MGTTX116_0_P: J1.66 ; port MGTTX116PN.MGTTX116_0_P
MGTTX116_1_N: J1.72 ; port MGTTX116PN.MGTTX116_1_N
MGTTX116_1_P: J1.70 ; port MGTTX116PN.MGTTX116_1_P
MGTTX116_2_N: J1.76 ; port MGTTX116PN.MGTTX116_2_N
MGTTX116_2_P: J1.74 ; port MGTTX116PN.MGTTX116_2_P
MGTTX116_3_N: J1.80 ; port MGTTX116PN.MGTTX116_3_N
MGTTX116_3_P: J1.78 ; port MGTTX116PN.MGTTX116_3_P
miniBACKPLANE_CLK_N: J1.84 ; port uTCA_CLK.miniBACKPLANE_CLK_N
miniBACKPLANE_CLK_P: J1.82 ; port uTCA_CLK.miniBACKPLANE_CLK_P
PB0: J2.57
PB1: J2.53
PB2: J2.55
PB3: J2.51
PB4: J2.59
PB5: J2.61
PB6: J2.49
PB7: J2.63
PE0: J2.69
PE1: J2.75
PE2: J2.73
PE3: J2.45
PE4: J2.43
PE5: J2.67
PE6: J2.71
PE7: J2.77
PE8: J2.41
PE9: J2.79
PE10: J2.33
PE11: J2.47
PE12: J2.35
PE13: J2.39
PE14: J2.37
PE15: J2.65
PLL_CLK_OUT: P8.1(X) ; port PLL_CLK_OUT
RD1: J2.23 ; port CPU_SSC.RD1  [project net CPU_SSC.RD1]
RF1: J2.27 ; port CPU_SSC.RF1  [project net CPU_SSC.RF1]
RK1: J2.25 ; port CPU_SSC.RK1  [project net CPU_SSC.RK1]
RS232_FPGA_RXD: P2.6 ; port RS232_MNG.RS232_FPGA_RXD
RS232_FPGA_TXD: P2.4 ; port RS232_MNG.RS232_FPGA_TXD
RS232_MNG_RXD: J2.3 ; port RS232_MNG.RS232_MNG_RXD  [project net RS232_MNG.RS232_MNG_RXD]
RS232_MNG_TXD: J2.1 ; port RS232_MNG.RS232_MNG_TXD  [project net RS232_MNG.RS232_MNG_TXD]
RX_N: CN1.6 ; port ETH_100MHz.RX_N  [project net ETH_100MHz.RX_N]
RX_P: CN1.3 ; port ETH_100MHz.RX_P  [project net ETH_100MHz.RX_P]
TD1: J2.21 ; port CPU_SSC.TD1  [project net CPU_SSC.TD1]
TF1: J2.17 ; port CPU_SSC.TF1  [project net CPU_SSC.TF1]
TK1: J2.19 ; port CPU_SSC.TK1  [project net CPU_SSC.TK1]
TX_N: CN1.2 ; port ETH_100MHz.TX_N  [project net ETH_100MHz.TX_N]
TX_P: CN1.1 ; port ETH_100MHz.TX_P  [project net ETH_100MHz.TX_P]
USB_5VBus: J2.7 ; port USB_5VBus
USB_DDP_N: J2.9 ; port CPU_USB.USB_DDP_N
USB_DDP_P: J2.11 ; port CPU_USB.USB_DDP_P
USB_HDP_N: J2.13 ; port CPU_USB.USB_HDP_N
USB_HDP_P: J2.15 ; port CPU_USB.USB_HDP_P
uTCA_TONGUE2_CLK1_N: CN2.10 ; port uTCA_CLK.uTCA_TONGUE2_CLK1_N  [project net uTCA_CLK.uTCA_TONGUE2_CLK1_N]
uTCA_TONGUE2_CLK1_P: CN2.12 ; port uTCA_CLK.uTCA_TONGUE2_CLK1_P  [project net uTCA_CLK.uTCA_TONGUE2_CLK1_P]
uTCA_TONGUE2_CLK2_N: CN2.16 ; port uTCA_CLK.uTCA_TONGUE2_CLK2_N  [project net uTCA_CLK.uTCA_TONGUE2_CLK2_N]
uTCA_TONGUE2_CLK2_P: CN2.18 ; port uTCA_CLK.uTCA_TONGUE2_CLK2_P  [project net uTCA_CLK.uTCA_TONGUE2_CLK2_P]
NetD5_2: J2.31 ; port EXT_NRST
NetP1_1: P1.1(X) ; port EXTPPSIN
NetP3_1: P3.1(X) ; port SYNC_OUT
NetP4_1: P4.1(X) ; port EXTPPSOUT

Not connected (* = marked no-connect by the designer): CN1 4 5 7 8; J1 86 88; J2 5; P5 12* 14*; P6 17* 19*

### Buses and harness runs
bus FPGA_GPIO[0..39] = port FPGA_GPIO[0..39]
bus PB[0..7] = port PB[0..7]
bus PE[0..15] = port PE[0..15]

### Layout directives
differential pair: DMTDCLK_mB_N, DMTDCLK_mB_P, ETH_100MHz.RX_N, ETH_100MHz.RX_P, ETH_100MHz.TX_N, ETH_100MHz.TX_P, EXTREFIN_10M_N, EXTREFIN_10M_P, FPGA_GCLK_N, FPGA_GCLK_P, MGTRX112_0_N, MGTRX112_0_P, MGTRX112_1_N, MGTRX112_1_P, MGTRX112_2_N, MGTRX112_2_P, MGTRX112_3_N, MGTRX112_3_P, MGTRX113_0_N, MGTRX113_0_P, MGTRX113_1_N, MGTRX113_1_P, MGTRX113_2_N, MGTRX113_2_P, MGTRX113_3_N, MGTRX113_3_P, MGTRX114_0_N, MGTRX114_0_P, MGTRX114_1_N, MGTRX114_1_P, MGTRX114_2_N, MGTRX114_2_P, MGTRX114_3_N, MGTRX114_3_P, MGTRX115_0_N, MGTRX115_0_P, MGTRX115_1_N, MGTRX115_1_P, MGTRX115_2_N, MGTRX115_2_P, MGTRX115_3_N, MGTRX115_3_P, MGTRX116_0_N, MGTRX116_0_P, MGTRX116_1_N, MGTRX116_1_P, MGTRX116_2_N, MGTRX116_2_P, MGTRX116_3_N, MGTRX116_3_P, MGTTX112_0_N, MGTTX112_0_P, MGTTX112_1_N, MGTTX112_1_P, MGTTX112_2_N, MGTTX112_2_P, MGTTX112_3_N, MGTTX112_3_P, MGTTX113_0_N, MGTTX113_0_P, MGTTX113_1_N, MGTTX113_1_P, MGTTX113_2_N, MGTTX113_2_P, MGTTX113_3_N, MGTTX113_3_P, MGTTX114_0_N, MGTTX114_0_P, MGTTX114_1_N, MGTTX114_1_P, MGTTX114_2_N, MGTTX114_2_P, MGTTX114_3_N, MGTTX114_3_P, MGTTX115_0_N, MGTTX115_0_P, MGTTX115_1_N, MGTTX115_1_P, MGTTX115_2_N, MGTTX115_2_P, MGTTX115_3_N, MGTTX115_3_P, MGTTX116_0_N, MGTTX116_0_P, MGTTX116_1_N, MGTTX116_1_P, MGTTX116_2_N, MGTTX116_2_P, MGTTX116_3_N, MGTTX116_3_P, uTCA_CLK.uTCA_TONGUE2_CLK1_N, uTCA_CLK.uTCA_TONGUE2_CLK1_P, uTCA_CLK.uTCA_TONGUE2_CLK2_N, uTCA_CLK.uTCA_TONGUE2_CLK2_P

### Notes on the sheet
- Copyright CERN 2014.
  This documentation describes Open Hardware and is licensed under the CERN OHL v. 1.2. You may redistribute and modify this documentation under the terms of the CERN OHL v.1.2. (http://ohwr.org/CERNOHL). This documentation is distributed WITHOUT ANY EXPRESS OR IMPLIED WARRANTY, INCLUDING OF MERCHANTABILITY, SATISFACTORY QUALITY AND FITNESS FOR A PARTICULAR PURPOSE. Please see the CERN OHL v.1.2 for applicable conditions.
- GND_CHASSIS is connected in the PCB to the nearest mounting hole to the Ethernet Connector CN1
- Labels drawn without touching a wire or pin: GND_SHIELD
- Title:
- Size:
- Revision:
- A3
- Drawn by:
- Date:
- Sheet
- of
- Project:
- (in symbol CON_ETHERNET_TYCO_1888250-1) RJ45; left; right

### Library data of the parts
CN1 = CON_ETHERNET_TYCO_1888250-1: low profile uTCA Ethernet jack (RJ45); RefId: Mouser/571-1888250-1; Value: 1888250-1; Distributor1 PN: A98526-ND; Distributor1: Digikey
CN2 = KX15_20p: multipin B2B connector (plug); Manufacturer1: JAE Electronics; Distributor1: Digikey; Manufacturer1 PN: KX15-20K4DE; Distributor1 PN: 670-1305-ND
J2 = QSS-048-01-L-D-DP: High Speed Ground Plane Header
J4 = PWR_JACK: Power Jack 5A @ 12V; LEVEL: STD; Mounted: No; PKG_TYPE: PWR_JACK; Value: DC10A; Distributor1 PN: 224959; Distributor1: Farnell
P1 P3 P4 P7 P8 = SMB: SMB Straight Connector; Value: 152123; LatestRevisionDate: 17-Jul-2002; LatestRevisionNote: Re-released for DXP Platform.; Publisher: Altium Limited; Distributor1 PN: ACX1509-ND; Distributor1: Digikey
P2 = MHDR2X3: SMD Header, 3-Pin, Dual row, 2.54mm pitch; Manufacturer1 PN: M22-5320305; Manufacturer1: Harwin; Distributor1: Digikey; Distributor1 PN: 952-1340-ND
P5 = Header 7X2: Header, 7-Pin, Dual row, 2.0 mm pitch; Manufacturer1: Molex; Manufacturer1 PN: 0878321421; Value: SBH21-NBPN-D07-SM-BK; LatestRevisionDate: 17-Jul-2002; LatestRevisionNote: Re-released for DXP Platform.; Publisher: Altium Limited; Distributor1 PN: WM4231-ND; Distributor1: Digikey
P6 = Header 10X2: Header, 10-Pin, Dual row, 2.54mm pitch; Manufacturer: Sullis Connectors; Value: SBH11-PBPC-D10-ST-BK; LatestRevisionDate: 17-Jul-2002; LatestRevisionNote: Re-released for DXP Platform.; Publisher: Altium Limited; Distributor1 PN: S9172-ND; Distributor1: Digikey
P9 = Header 3: Header, 3-Pin; Manufacturer1: GLOBAL CONNECTOR TECHNOLOGY; Manufacturer1 PN: BG055-03A-1-0450-0530-0350-L-G; Mounted: No; LatestRevisionDate: 17-Jul-2002; LatestRevisionNote: Re-released for DXP Platform.; Publisher: Altium Limited; Distributor1 PN: 1798981; Distributor1: Farnell

## Sheet CPU_JTAG_Power_PLL.SchDoc: CPU_JTAG_Power_PLL
size A4 portrait; Revision: 3.4; SheetNumber: 13; SheetTotal: 23; Date: 18/06/2014; DrawnBy: J. Gabriel R.E.; Organization: Seven Solutions S.L.; Address1: C/Baza, Parcela 19, Nave 3; Address2: Polígono Ind. Juncaril; Address3: 18210-Peligros-Granada; Address4: Spain; WebAddress: www.sevensols.com; Project: White Rabbit; ProjectName: White Rabbit
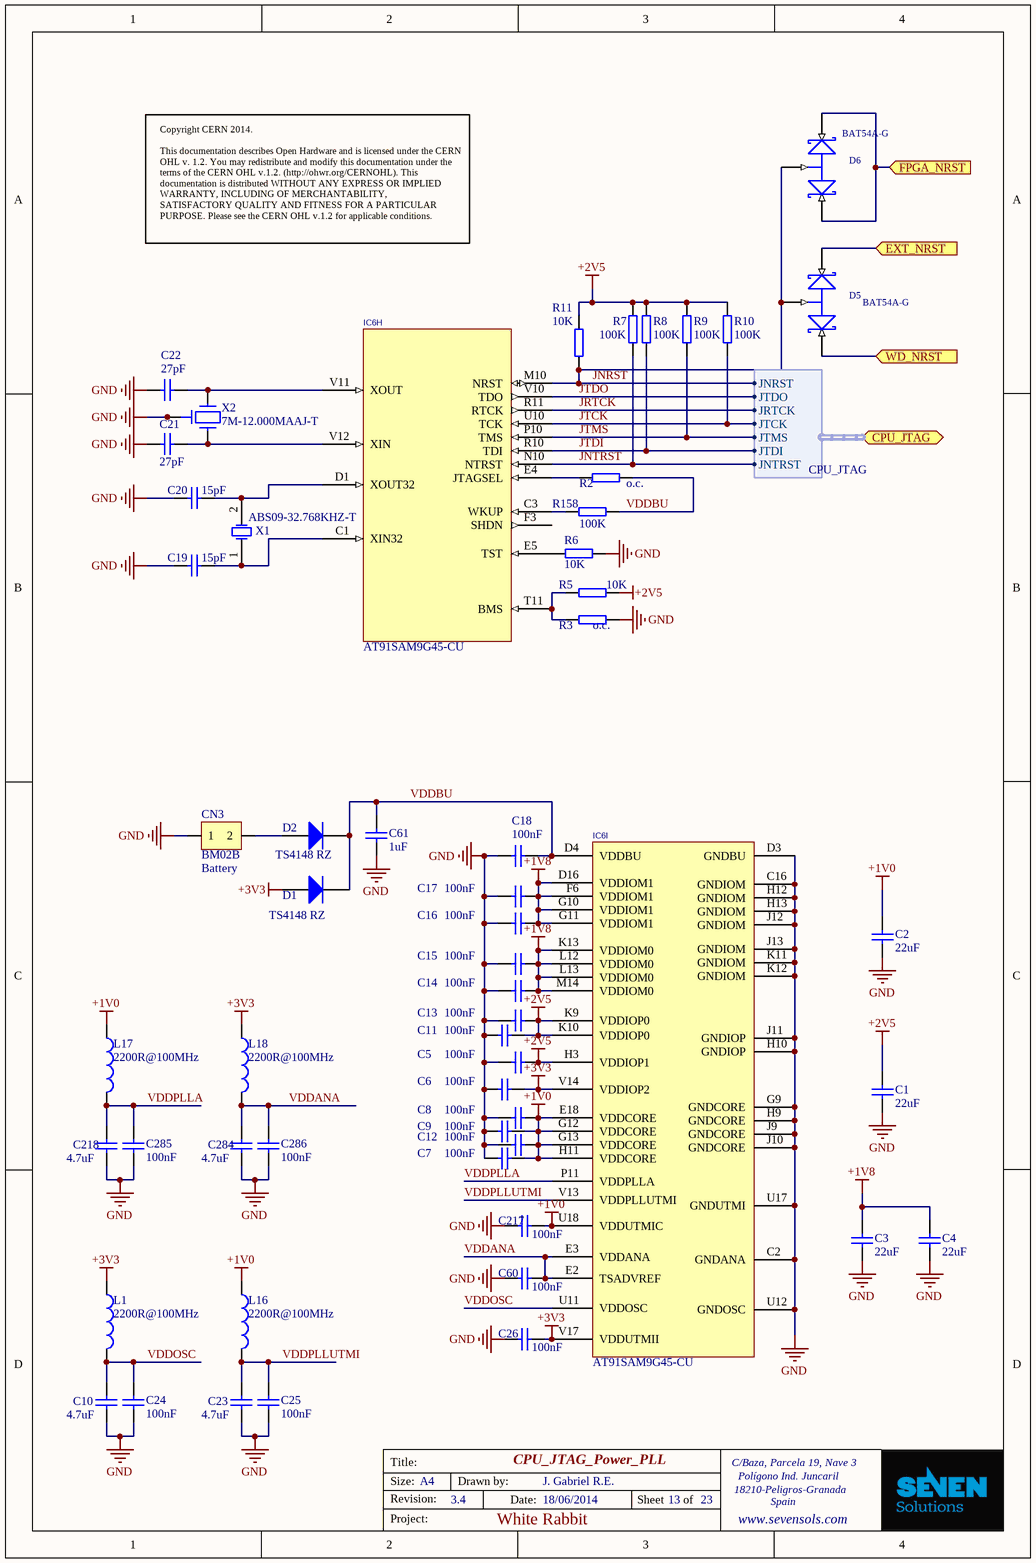
[diagram p3: CPU_JTAG_Power_PLL.SchDoc]

### Parts
C1  22uF  [CC2012-0805]
C2  22uF  [CC2012-0805]
C3  22uF  [CC2012-0805]
C4  22uF  [CC2012-0805]
C5  100nF  [CC1005-0402]
C6  100nF  [CC1005-0402]
C7  100nF  [CC1005-0402]
C8  100nF  [CC1005-0402]
C9  100nF  [CC1005-0402]
C10  4.7uF  [CC1608-0603]
C11  100nF  [CC1005-0402]
C12  100nF  [CC1005-0402]
C13  100nF  [CC1005-0402]
C14  100nF  [CC1005-0402]
C15  100nF  [CC1005-0402]
C16  100nF  [CC1005-0402]
C17  100nF  [CC1005-0402]
C18  100nF  [CC1005-0402]
C19  15pF  [CC1005-0402]
C20  15pF  [CC1005-0402]
C21  27pF  [CC1005-0402]
C22  27pF  [CC1005-0402]
C23  4.7uF  [CC1608-0603]
C24  100nF  [CC1005-0402]
C25  100nF  [CC1005-0402]
C26  100nF  [CC1005-0402]
C60  100nF  [CC1005-0402]
C61  1uF  [CC1005-0402]
C217  100nF  [CC1005-0402]
C218  4.7uF  [CC1608-0603]
C284  4.7uF  [CC1608-0603]
C285  100nF  [CC1005-0402]
C286  100nF  [CC1005-0402]
CN3  BM02B  Comment2: Battery  [SH_CRIMP_1MM_2]
D1  TS4148 RZ  [CD1608-0603]
D2  TS4148 RZ  [CD1608-0603]
D5  BAT54A-G  [SOT23]
D6  BAT54A-G  [SOT23]
IC6  AT91SAM9G45-CU  [TFBGA324]  (parts H,I of 12)
L1  Impedance: 2200R@100MHz  [0805]  (hidden comment: 2200R@100MHz Ferrite Bead)
L16  Impedance: 2200R@100MHz  [0805]  (hidden comment: 2200R@100MHz Ferrite Bead)
L17  Impedance: 2200R@100MHz  [0805]  (hidden comment: 2200R@100MHz Ferrite Bead)
L18  Impedance: 2200R@100MHz  [0805]  (hidden comment: 2200R@100MHz Ferrite Bead)
R2  o.c.  [0402]
R3  o.c.  [0402]
R5  10k  [0402]
R6  10k  [0402]
R7  100K  [0402]
R8  100K  [0402]
R9  100K  [0402]
R10  100K  [0402]
R11  10k  [0402]
R158  100K  [0402]
X1  ABS09-32.768KHZ-T  [XTAL_abs09]
X2  7M-12.000MAAJ-T  [OSC_IQD_CFPS-39]

### Ports
CPU_JTAG (harness CPU_JTAG), EXT_NRST (in), FPGA_NRST (in), WD_NRST (in)

### Harnesses
CPU_JTAG: JNRST, JTDO, JRTCK, JTCK, JTMS, JTDI, JNTRST

### Nets
+1V0: C2.2 C7.1 C8.1 C9.1 C12.1 C217.2 IC6.E18(VDDCORE) IC6.G12(VDDCORE) IC6.G13(VDDCORE) IC6.H11(VDDCORE) IC6.U18(VDDUTMIC) L16.1 L17.1
+1V8: C3.2 C4.2 C14.1 C15.1 C16.1 C17.1 IC6.D16(VDDIOM1) IC6.F6(VDDIOM1) IC6.G10(VDDIOM1) IC6.G11(VDDIOM1) IC6.K13(VDDIOM0) IC6.L12(VDDIOM0) IC6.L13(VDDIOM0) IC6.M14(VDDIOM0)
+2V5: C1.2 C5.1 C11.1 C13.1 IC6.H3(VDDIOP1) IC6.K9(VDDIOP0) IC6.K10(VDDIOP0) R5.1 R7.2 R8.2 R9.2 R10.2 R11.2
+3V3: C6.1 C26.2 D1.1(A) IC6.V14(VDDIOP2) IC6.V17(VDDUTMII) L1.1 L18.1
GND: C1.1 C2.1 C3.1 C4.1 C5.2 C6.2 C7.2 C8.2 C9.2 C10.1 C11.2 C12.2 C13.2 C14.2 C15.2 C16.2 C17.2 C18.2 C19.1 C20.1 C21.1 C22.1 C23.1 C24.2 C25.2 C26.1 C60.1 C61.1 C217.1 C218.1 C284.1 C285.2 C286.2 CN3.1 IC6.C2(GNDANA) IC6.C16(GNDIOM) IC6.D3(GNDBU) IC6.G9(GNDCORE) IC6.H9(GNDCORE) IC6.H10(GNDIOP) IC6.H12(GNDIOM) IC6.H13(GNDIOM) IC6.J9(GNDCORE) IC6.J10(GNDCORE) IC6.J11(GNDIOP) IC6.J12(GNDIOM) IC6.J13(GNDIOM) IC6.K11(GNDIOM) IC6.K12(GNDIOM) IC6.U12(GNDOSC) IC6.U17(GNDUTMI) R3.2 R6.1 X2.2 X2.4
ARM_NRST: D6.1(K1) D6.2(K2) ; port FPGA_NRST
ARM_WD_RST: D5.1(K1) ; port WD_NRST
JNRST: D5.3(A) D6.3(A) IC6.M10(NRST) R11.1 ; port CPU_JTAG.JNRST  [project net CPU_JTAG.JNRST]
JNTRST: IC6.N10(NTRST) R7.1 ; port CPU_JTAG.JNTRST  [project net CPU_JTAG.JNTRST]
JRTCK: IC6.R11(RTCK) ; port CPU_JTAG.JRTCK  [project net CPU_JTAG.JRTCK]
JTCK: IC6.U10(TCK) R10.1 ; port CPU_JTAG.JTCK  [project net CPU_JTAG.JTCK]
JTDI: IC6.R10(TDI) R8.1 ; port CPU_JTAG.JTDI  [project net CPU_JTAG.JTDI]
JTDO: IC6.V10(TDO) ; port CPU_JTAG.JTDO  [project net CPU_JTAG.JTDO]
JTMS: IC6.P10(TMS) R9.1 ; port CPU_JTAG.JTMS  [project net CPU_JTAG.JTMS]
VDDANA: C60.2 C284.2 C286.1 IC6.E2(TSADVREF) IC6.E3(VDDANA) L18.2
VDDBU: C18.1 C61.2 D1.2(K) D2.2(K) IC6.D4(VDDBU) R2.2 R158.2
VDDOSC: C10.2 C24.1 IC6.U11(VDDOSC) L1.2
VDDPLLA: C218.2 C285.1 IC6.P11(VDDPLLA) L17.2
VDDPLLUTMI: C23.2 C25.1 IC6.V13(VDDPLLUTMI) L16.2
NetC19_2: C19.2 IC6.C1(XIN32) X1.1(OSC1)
NetC20_2: C20.2 IC6.D1(XOUT32) X1.2(OSC2)
NetC21_2: C21.2 IC6.V12(XIN) X2.3
NetC22_2: C22.2 IC6.V11(XOUT) X2.1
NetCN3_2: CN3.2 D2.1(A)
NetD5_2: D5.2(K2) ; port EXT_NRST
NetIC6_C3: IC6.C3(WKUP) R158.1
NetIC6_E4: IC6.E4(JTAGSEL) R2.1
NetIC6_E5: IC6.E5(TST) R6.2
NetIC6_T11: IC6.T11(BMS) R3.1 R5.2

Not connected (* = marked no-connect by the designer): IC6 F3(SHDN)

### Notes on the sheet
- Copyright CERN 2014.
  This documentation describes Open Hardware and is licensed under the CERN OHL v. 1.2. You may redistribute and modify this documentation under the terms of the CERN OHL v.1.2. (http://ohwr.org/CERNOHL). This documentation is distributed WITHOUT ANY EXPRESS OR IMPLIED WARRANTY, INCLUDING OF MERCHANTABILITY, SATISFACTORY QUALITY AND FITNESS FOR A PARTICULAR PURPOSE. Please see the CERN OHL v.1.2 for applicable conditions.
- Title:
- Size:
- Revision:
- A4
- Drawn by:
- Date:
- Sheet
- of
- Project:

### Library data of the parts
C1-C4 = CC0805_22UF_6.3V_20%_X5R: Capacitor; Manufacturer1: TDK; Manufacturer1 PN: C2012X5R0J226M; TC: X5R; Tolerance: ±20%; Voltage: 6.3V; Published: 8-Jun-2000; LatestRevisionDate: 17-Jul-2002; LatestRevisionNote: Re-released for DXP Platform.; PackageReference: RAD-0.3; Publisher: Altium Limited; Distributor1: Digikey; Distributor1 PN: 445-1422-1-ND; Case: 0805; Value: 22uF
C5-C9 C11-C18 C24-C26 C60 C217 C285 C286 = CC0402_100NF_16V_10%_X7R: Capacitor; Manufacturer1: TDK; Manufacturer1 PN: C1005X7R1C104K; TC: X7R; Tolerance: ±10%; Voltage: 16V; Published: 8-Jun-2000; LatestRevisionDate: 17-Jul-2002; LatestRevisionNote: Re-released for DXP Platform.; PackageReference: RAD-0.3; Publisher: Altium Limited; Distributor1: Digikey; Distributor1 PN: 445-4952-1-ND; Case: 0402; Value: 100nF
C10 C23 C218 C284 = CC0603_4.7UF_10V_10%_X5R: Capacitor; Manufacturer1: TDK; Manufacturer1 PN: C1608X5R1A475K; TC: X5R; Tolerance: ±10%; Voltage: 10V; Published: 8-Jun-2000; LatestRevisionDate: 17-Jul-2002; LatestRevisionNote: Re-released for DXP Platform.; PackageReference: RAD-0.3; Publisher: Altium Limited; Distributor1: Digikey; Distributor1 PN: 445-5170-1-ND; Case: 0603; Value: 4.7uF
C19 C20 = CC0402_15PF_50V_5%_NP0: Capacitor; Manufacturer1: TDK; Manufacturer1 PN: C1005C0G1H150J; TC: NP0; Tolerance: ±5%; Voltage: 50V; Published: 8-Jun-2000; LatestRevisionDate: 17-Jul-2002; LatestRevisionNote: Re-released for DXP Platform.; PackageReference: RAD-0.3; Publisher: Altium Limited; Distributor1: Digikey; Distributor1 PN: 445-1237-1-ND; Case: 0402; Value: 15pF
C21 C22 = CC0402_27PF_50V_5%_NP0: Capacitor; Manufacturer1: TDK; Manufacturer1 PN: C1005C0G1H270J; TC: NP0; Tolerance: ±5%; Voltage: 50V; Published: 8-Jun-2000; LatestRevisionDate: 17-Jul-2002; LatestRevisionNote: Re-released for DXP Platform.; PackageReference: RAD-0.3; Publisher: Altium Limited; Distributor1: Digikey; Distributor1 PN: 445-1240-1-ND; Case: 0402; Value: 27pF
C61 = CC0402_1UF_16V_10%_X5R: Capacitor; Manufacturer1: TDK; Manufacturer1 PN: C1005X5R1C105K; TC: X5R; Tolerance: ±10%; Voltage: 16V; Published: 8-Jun-2000; LatestRevisionDate: 17-Jul-2002; LatestRevisionNote: Re-released for DXP Platform.; PackageReference: RAD-0.3; Publisher: Altium Limited; Distributor1: Digikey; Distributor1 PN: 445-4978-1-ND; Case: 0402; Value: 1uF
CN3 = CON_SH_CRIMP_1MM_2: Manufacturer1: Japan Solderless Terminals; Manufacturer1 PN: BM02B-SRSS-TB(LF)(SN); Distributor1 PN: 1679127; Distributor1: Farnell
D1 D2 = Diode: Default Diode; Published: 8-Jun-2000; LatestRevisionDate: 17-Jul-2002; LatestRevisionNote: Re-released for DXP Platform.; PackageDocument: Sep-1996; PackageReference: SMC; Publisher: Altium Limited; Code_JEDEC: DO-214-AB; Value: TS4148 RZ; Distributor1 PN: 8150192; Distributor1: Farnell
D5 D6 = BAT54A.1: Schottky Barrier Double Diode; PACKAGE_INFORMATION: Latest Revision: May-1999; DEVICE: BAT54A-G; PKG_TYPE: SOT23; PUBLISHED: 17-Sep-2003; DATASHEET: Latest Revision: 4-Mar-2002; PACKAGE_REFERENCE: SOT23; PUBLISHER: Altium Limited; Value: BAT54A-G; Distributor1 PN: 641-1319-1-ND; Distributor1: Digikey
IC6 = AT91SAM9G45-CU: Atmel 400MHz ARM926 MCU; Value: AT91SAM9G45-CU; Distributor1 PN: AT91SAM9G45-CU-ND; Distributor1: Digikey
L1 L16-L18 = L_FERRITE_BEAD: ferrite bead; Manufacturer1: Wurth Electronics; Manufacturer1 PN: 742792093; Current Rating: 0.2A; DCR: 600mOhm; Case: 0805; Distributor1: Digikey; Distributor1 PN: 732-1609-1-ND
R2 R3 = R0402_O.C.: SMD Resistor; Mounted: No; Case: 0402; Manufacturer1: N/A; Manufacturer1 PN: N/A; Distributor1: N/A; Distributor1 PN: N/A; TCR: N/A; Power Rating: N/A; Tolerance: N/A; Value: o.c.
R5 R6 R11 = R0402_10K_±1%_0.1W_100PPM: SMD Resistor; Manufacturer1: Panasonic; Manufacturer1 PN: ERJ-2RKF1002X; TCR: 100ppm; Power Rating: 0.1W; Tolerance: ±1%; Case: 0402; Distributor1: DigiKey; Distributor1 PN: P10.0KLCT-ND; Value: 10K
R7-R10 R158 = R0402_100K_±1%_0.1W_100PPM: SMD Resistor; Manufacturer1: Panasonic; Manufacturer1 PN: ERJ-2RKF1003X; TCR: 100ppm; Power Rating: 0.1W; Tolerance: ±1%; Case: 0402; Distributor1: DigiKey; Distributor1 PN: P100KLCT-ND; Value: 100K
X1 = XTAL: Crystal Oscillator 12pF; Manufacturer: Raltron; Published: 8-Jun-2000; LatestRevisionDate: 17-Jul-2002; LatestRevisionNote: Re-released for DXP Platform.; PackageReference: R38; Publisher: Altium Limited; Value: ABS09-32.768KHZ-T; Distributor1: Farnell; Distributor1 PN: 1633671
X2 = X_CRYSTAL_SMD_7M: SMD Crystal 7M Series 18pF 30 ppm; Value: 7M-12.000MAAJ-T; Distributor1 PN: 887-1121-1-ND; Distributor1: Digikey

## Sheet RS232_and_USB_ports.SchDoc: RS232_and_USB_ports
size A4 portrait; Revision: 3.4; SheetNumber: 4; SheetTotal: 23; Date: 18/06/2014; DrawnBy: J. Gabriel R.E.; Organization: Seven Solutions S.L.; Address1: C/Baza, Parcela 19, Nave 3; Address2: Polígono Ind. Juncaril; Address3: 18210-Peligros-Granada; Address4: Spain; WebAddress: www.sevensols.com; Project: White Rabbit; ProjectName: White Rabbit
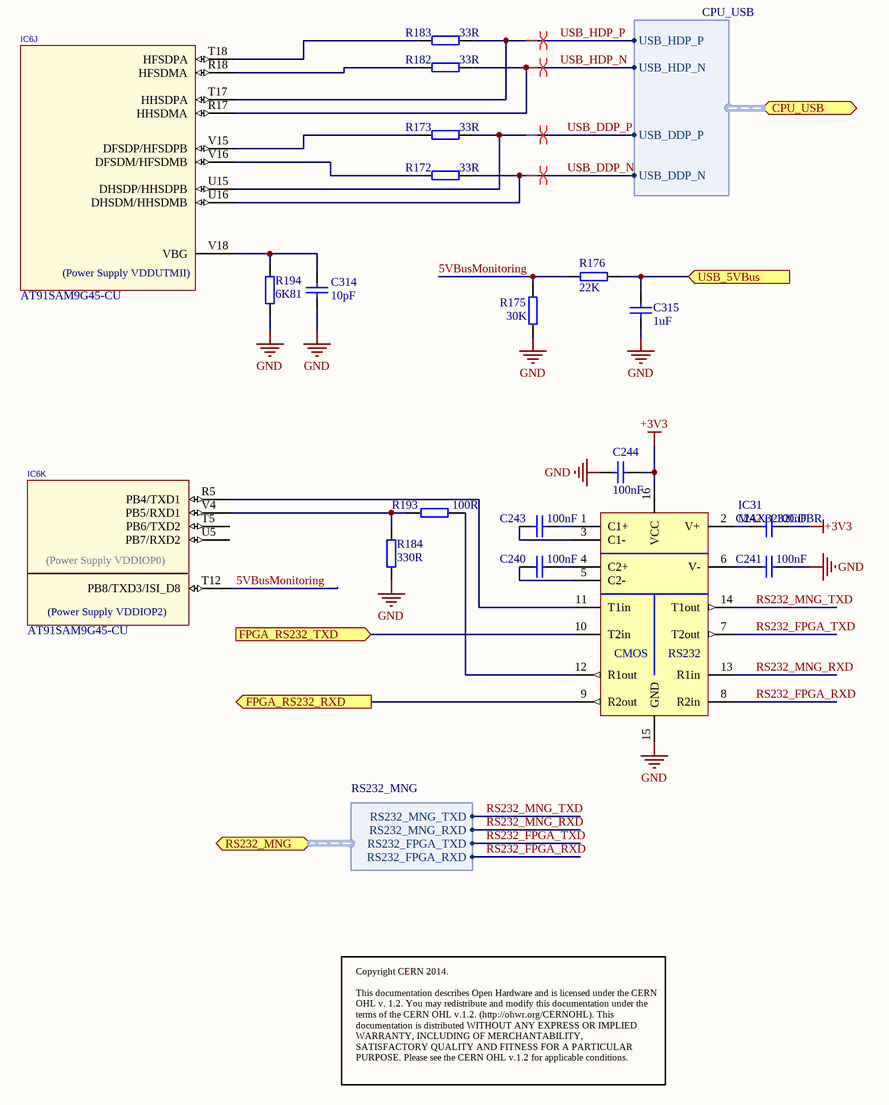
[diagram p4: RS232_and_USB_ports.SchDoc]

### Parts
C240  100nF  [CC1005-0402]
C241  100nF  [CC1005-0402]
C242  100nF  [CC1005-0402]
C243  100nF  [CC1005-0402]
C244  100nF  [CC1005-0402]
C314  10pF  [CC1005-0402]
C315  1uF  [CC1005-0402]
IC6  AT91SAM9G45-CU  [TFBGA324]  (parts J,K of 12)
IC31  MAX3232CDBR  [SOP65P780X200-16N]
R172  33R  [0603]
R173  33R  [0603]
R175  30K  [0402]
R176  22K  [0402]
R182  33R  [0603]
R183  33R  [0603]
R184  330R  [0402]
R193  100R  [0402]
R194  6K81  [0402]

### Ports
CPU_USB (harness CPU_USB), FPGA_RS232_RXD (out), FPGA_RS232_TXD (in), RS232_MNG (harness RS232_MNG), USB_5VBus (in)

### Harnesses
RS232_MNG: RS232_MNG_TXD, RS232_FPGA_TXD, RS232_MNG_RXD, RS232_FPGA_RXD
CPU_USB: USB_HDP_P, USB_HDP_N, USB_DDP_P, USB_DDP_N

### Nets
+3V3: C242.1 C244.1 IC31.16(VCC)
GND: C241.1 C244.2 C314.1 C315.2 IC31.15(GND) R175.1 R184.2 R194.1
5VBusMonitoring: IC6.T12(PB8/TXD3/ISI_D8) R175.2 R176.2
FPGA_RS232_RXD: IC31.9(R2out) ; port FPGA_RS232_RXD
FPGA_RS232_TXD: IC31.10(T2in) ; port FPGA_RS232_TXD
RS232_FPGA_RXD: IC31.8(R2in) ; port RS232_MNG.RS232_FPGA_RXD
RS232_FPGA_TXD: IC31.7(T2out) ; port RS232_MNG.RS232_FPGA_TXD
RS232_MNG_RXD: IC31.13(R1in) ; port RS232_MNG.RS232_MNG_RXD  [project net RS232_MNG.RS232_MNG_RXD]
RS232_MNG_TXD: IC31.14(T1out) ; port RS232_MNG.RS232_MNG_TXD  [project net RS232_MNG.RS232_MNG_TXD]
USB_5VBus: C315.1 R176.1 ; port USB_5VBus
USB_DDP_N: IC6.U16(DHSDM/HHSDMB) R172.2 ; port CPU_USB.USB_DDP_N
USB_DDP_P: IC6.U15(DHSDP/HHSDPB) R173.2 ; port CPU_USB.USB_DDP_P
USB_HDP_N: IC6.R17(HHSDMA) R182.2 ; port CPU_USB.USB_HDP_N
USB_HDP_P: IC6.T17(HHSDPA) R183.2 ; port CPU_USB.USB_HDP_P
NetC240_1: C240.1 IC31.4(C2+)
NetC240_2: C240.2 IC31.5(C2-)
NetC241_2: C241.2 IC31.6(V-)
NetC242_2: C242.2 IC31.2(V+)
NetC243_1: C243.1 IC31.1(C1+)
NetC243_2: C243.2 IC31.3(C1-)
NetC314_2: C314.2 IC6.V18(VBG) R194.2
NetIC6_R5: IC6.R5(PB4/TXD1) IC31.11(T1in)
NetIC6_R18: IC6.R18(HFSDMA) R182.1
NetIC6_T18: IC6.T18(HFSDPA) R183.1
NetIC6_V4: IC6.V4(PB5/RXD1) R184.1 R193.2
NetIC6_V15: IC6.V15(DFSDP/HFSDPB) R173.1
NetIC6_V16: IC6.V16(DFSDM/HFSDMB) R172.1
NetIC31_12: IC31.12(R1out) R193.1

Not connected (* = marked no-connect by the designer): IC6 T5(PB6/TXD2) U5(PB7/RXD2)

### Layout directives
differential pair: USB_DDP_N, USB_DDP_P, USB_HDP_N, USB_HDP_P

### Notes on the sheet
- Copyright CERN 2014.
  This documentation describes Open Hardware and is licensed under the CERN OHL v. 1.2. You may redistribute and modify this documentation under the terms of the CERN OHL v.1.2. (http://ohwr.org/CERNOHL). This documentation is distributed WITHOUT ANY EXPRESS OR IMPLIED WARRANTY, INCLUDING OF MERCHANTABILITY, SATISFACTORY QUALITY AND FITNESS FOR A PARTICULAR PURPOSE. Please see the CERN OHL v.1.2 for applicable conditions.
- Title:
- Size:
- Revision:
- A4
- Drawn by:
- Date:
- Sheet
- of
- Project:
- (in symbol AT91SAM9G45-CU, part J) (Power Supply VDDUTMII)
- (in symbol AT91SAM9G45-CU, part K) (Power Supply VDDIOP0); (Power Supply VDDIOP2)
- (in symbol IFC_MAX3232) CMOS; RS232

### Library data of the parts
C240-C244 = CC0402_100NF_16V_10%_X7R: as C5 on sheet CPU_JTAG_Power_PLL; Published: 8-Jun-2000; LatestRevisionDate: 17-Jul-2002; LatestRevisionNote: Re-released for DXP Platform.; PackageReference: RAD-0.3; Publisher: Altium Limited; Distributor1: Digikey; Distributor1 PN: 445-4952-1-ND; Case: 0402; Value: 100nF
C314 = CC0402_10PF_50V_5%_NP0: Capacitor; Manufacturer1: TDK; Manufacturer1 PN: C1005C0G1H100D; TC: NPO; Tolerance: ±10%; Voltage: 50V; Published: 8-Jun-2000; LatestRevisionDate: 17-Jul-2002; LatestRevisionNote: Re-released for DXP Platform.; PackageReference: RAD-0.3; Publisher: Altium Limited; Distributor1: Digikey; Distributor1 PN: 445-1235-1-ND; Case: 0402; Value: 10pF
C315 = CC0402_1UF_16V_10%_X5R: as C61 on sheet CPU_JTAG_Power_PLL; Published: 8-Jun-2000; LatestRevisionDate: 17-Jul-2002; LatestRevisionNote: Re-released for DXP Platform.; PackageReference: RAD-0.3; Publisher: Altium Limited; Distributor1: Digikey; Distributor1 PN: 445-4978-1-ND; Case: 0402; Value: 1uF
IC6 = AT91SAM9G45-CU: Atmel 400MHz ARM926 MCU; Value: AT91SAM9G45-CU; Distributor1 PN: AT91SAM9G45-CU-ND; Distributor1: Digikey
IC31 = IFC_MAX3232: Manufacturer1: Texas Instruments; Distributor1: Digikey; Distributor1 PN: 296-13093-1-ND; Manufacturer1 PN: MAX3232CDBR
R172 R173 R182 R183 = R0603_33R_±1%_0.25W_100PPM: SMD Resistor; Manufacturer1: Vishay/Dale; Manufacturer1 PN: CRCW060333R0FKEAHP; TCR: 100ppm; Power Rating: 0.25W; Tolerance: ±1%; Case: 0402; Distributor1: DigiKey; Distributor1 PN: 541-33.0SCT-ND; Value: 33R
R175 = R0402_30K_±1%_0.1W_100PPM: SMD Resistor; Manufacturer1: Panasonic; Manufacturer1 PN: ERJ-2RKF3002X; TCR: 100ppm; Power Rating: 0.1W; Tolerance: ±1%; Case: 0402; Distributor1: DigiKey; Distributor1 PN: P30.0KLCT-ND; Value: 30K
R176 = R0402_22K_±1%_0.1W_100PPM: SMD Resistor; Manufacturer1: Panasonic; Manufacturer1 PN: ERJ-2RKF2202X; TCR: 100ppm; Power Rating: 0.1W; Tolerance: ±1%; Case: 0402; Distributor1: DigiKey; Distributor1 PN: P22.0KLCT-ND; Value: 22K
R184 = R0402_330R_±1%_0.1W_100PPM: SMD Resistor; Manufacturer1: Panasonic; Manufacturer1 PN: ERJ-2RKF3300X; TCR: 100ppm; Power Rating: 0.1W; Tolerance: ±1%; Case: 0402; Distributor1: DigiKey; Distributor1 PN: P330LCT-ND; Value: 330R
R193 = R0402_100R_±1%_0.1W_100PPM: SMD Resistor; Manufacturer1: Panasonic; Manufacturer1 PN: ERJ-2RKF1000X; TCR: 100ppm; Power Rating: 0.1W; Tolerance: ±1%; Case: 0402; Distributor1: DigiKey; Distributor1 PN: P100LCT-ND; Value: 100R
R194 = R0402_6K81_±1%_0.1W_100PPM: SMD Resistor; Manufacturer1: Panasonic; Manufacturer1 PN: ERJ-2RKF6811X; TCR: 100ppm; Power Rating: 0.1W; Tolerance: ±1%; Case: 0402; Distributor1: DigiKey; Distributor1 PN: P6.81KLCT-ND; Value: 6K81